# EasyEDA Pro project ProProject_FPGA_oscilloscope Analog pre circuit PCB_2024-05-13.epro, board PCB6
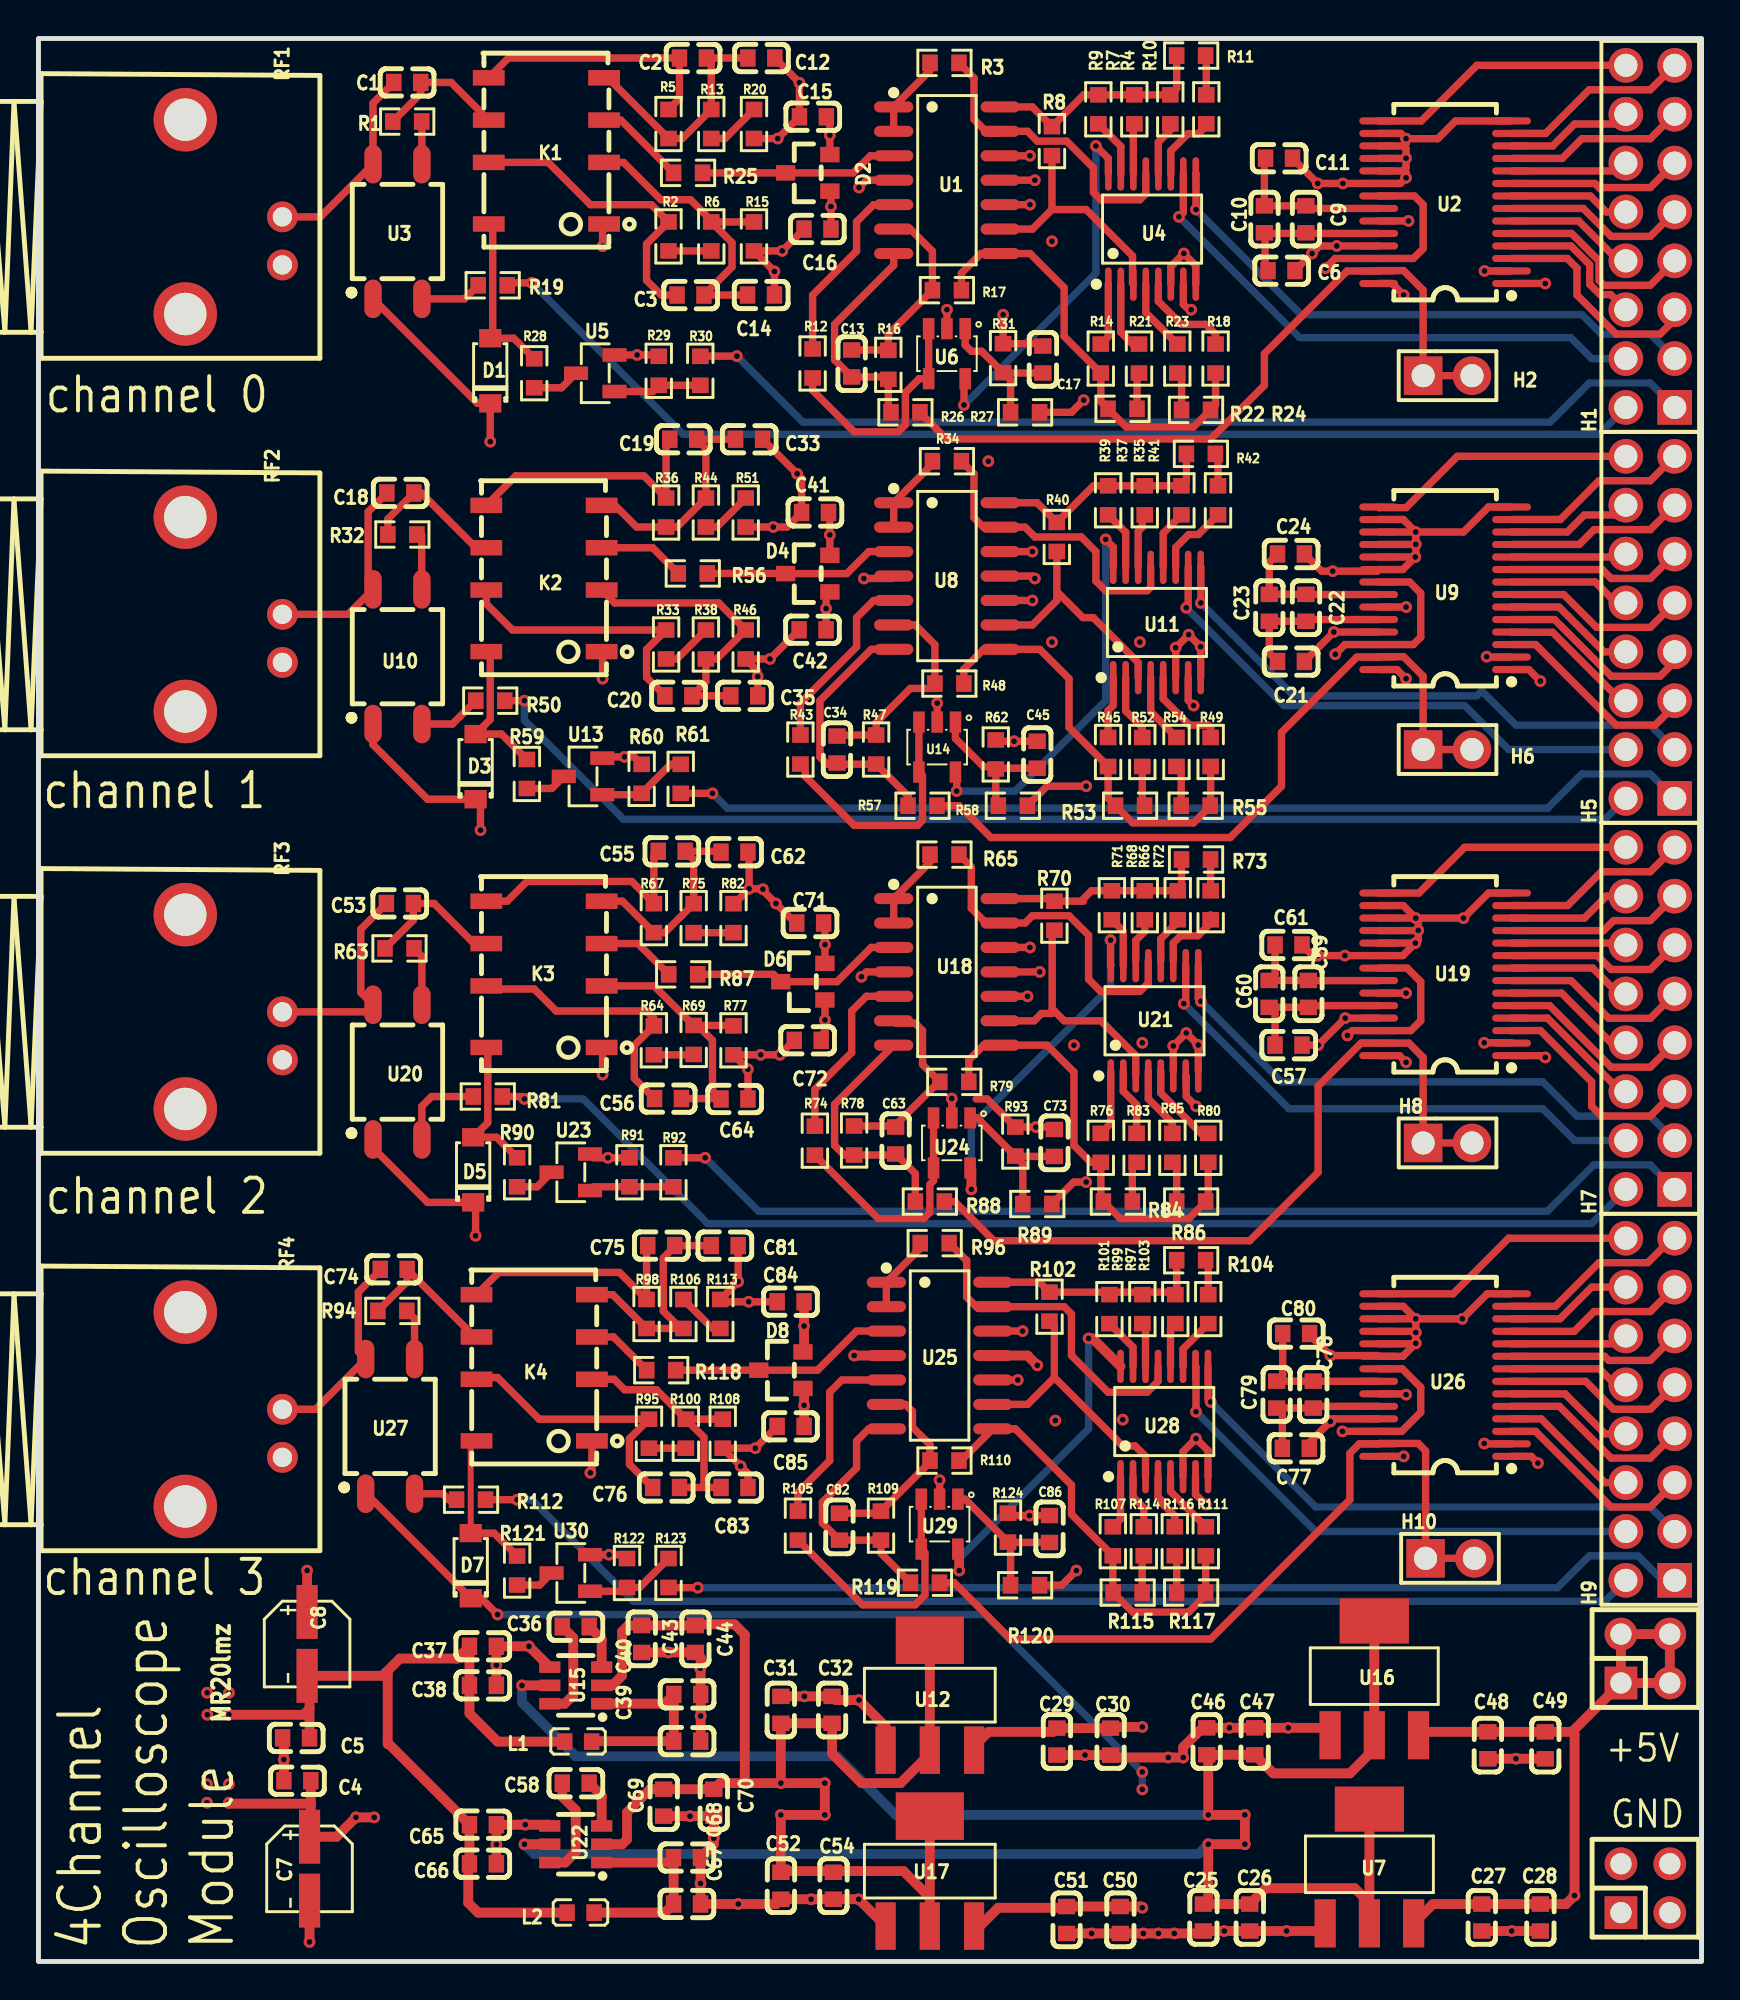
[diagram p9: board, top side]
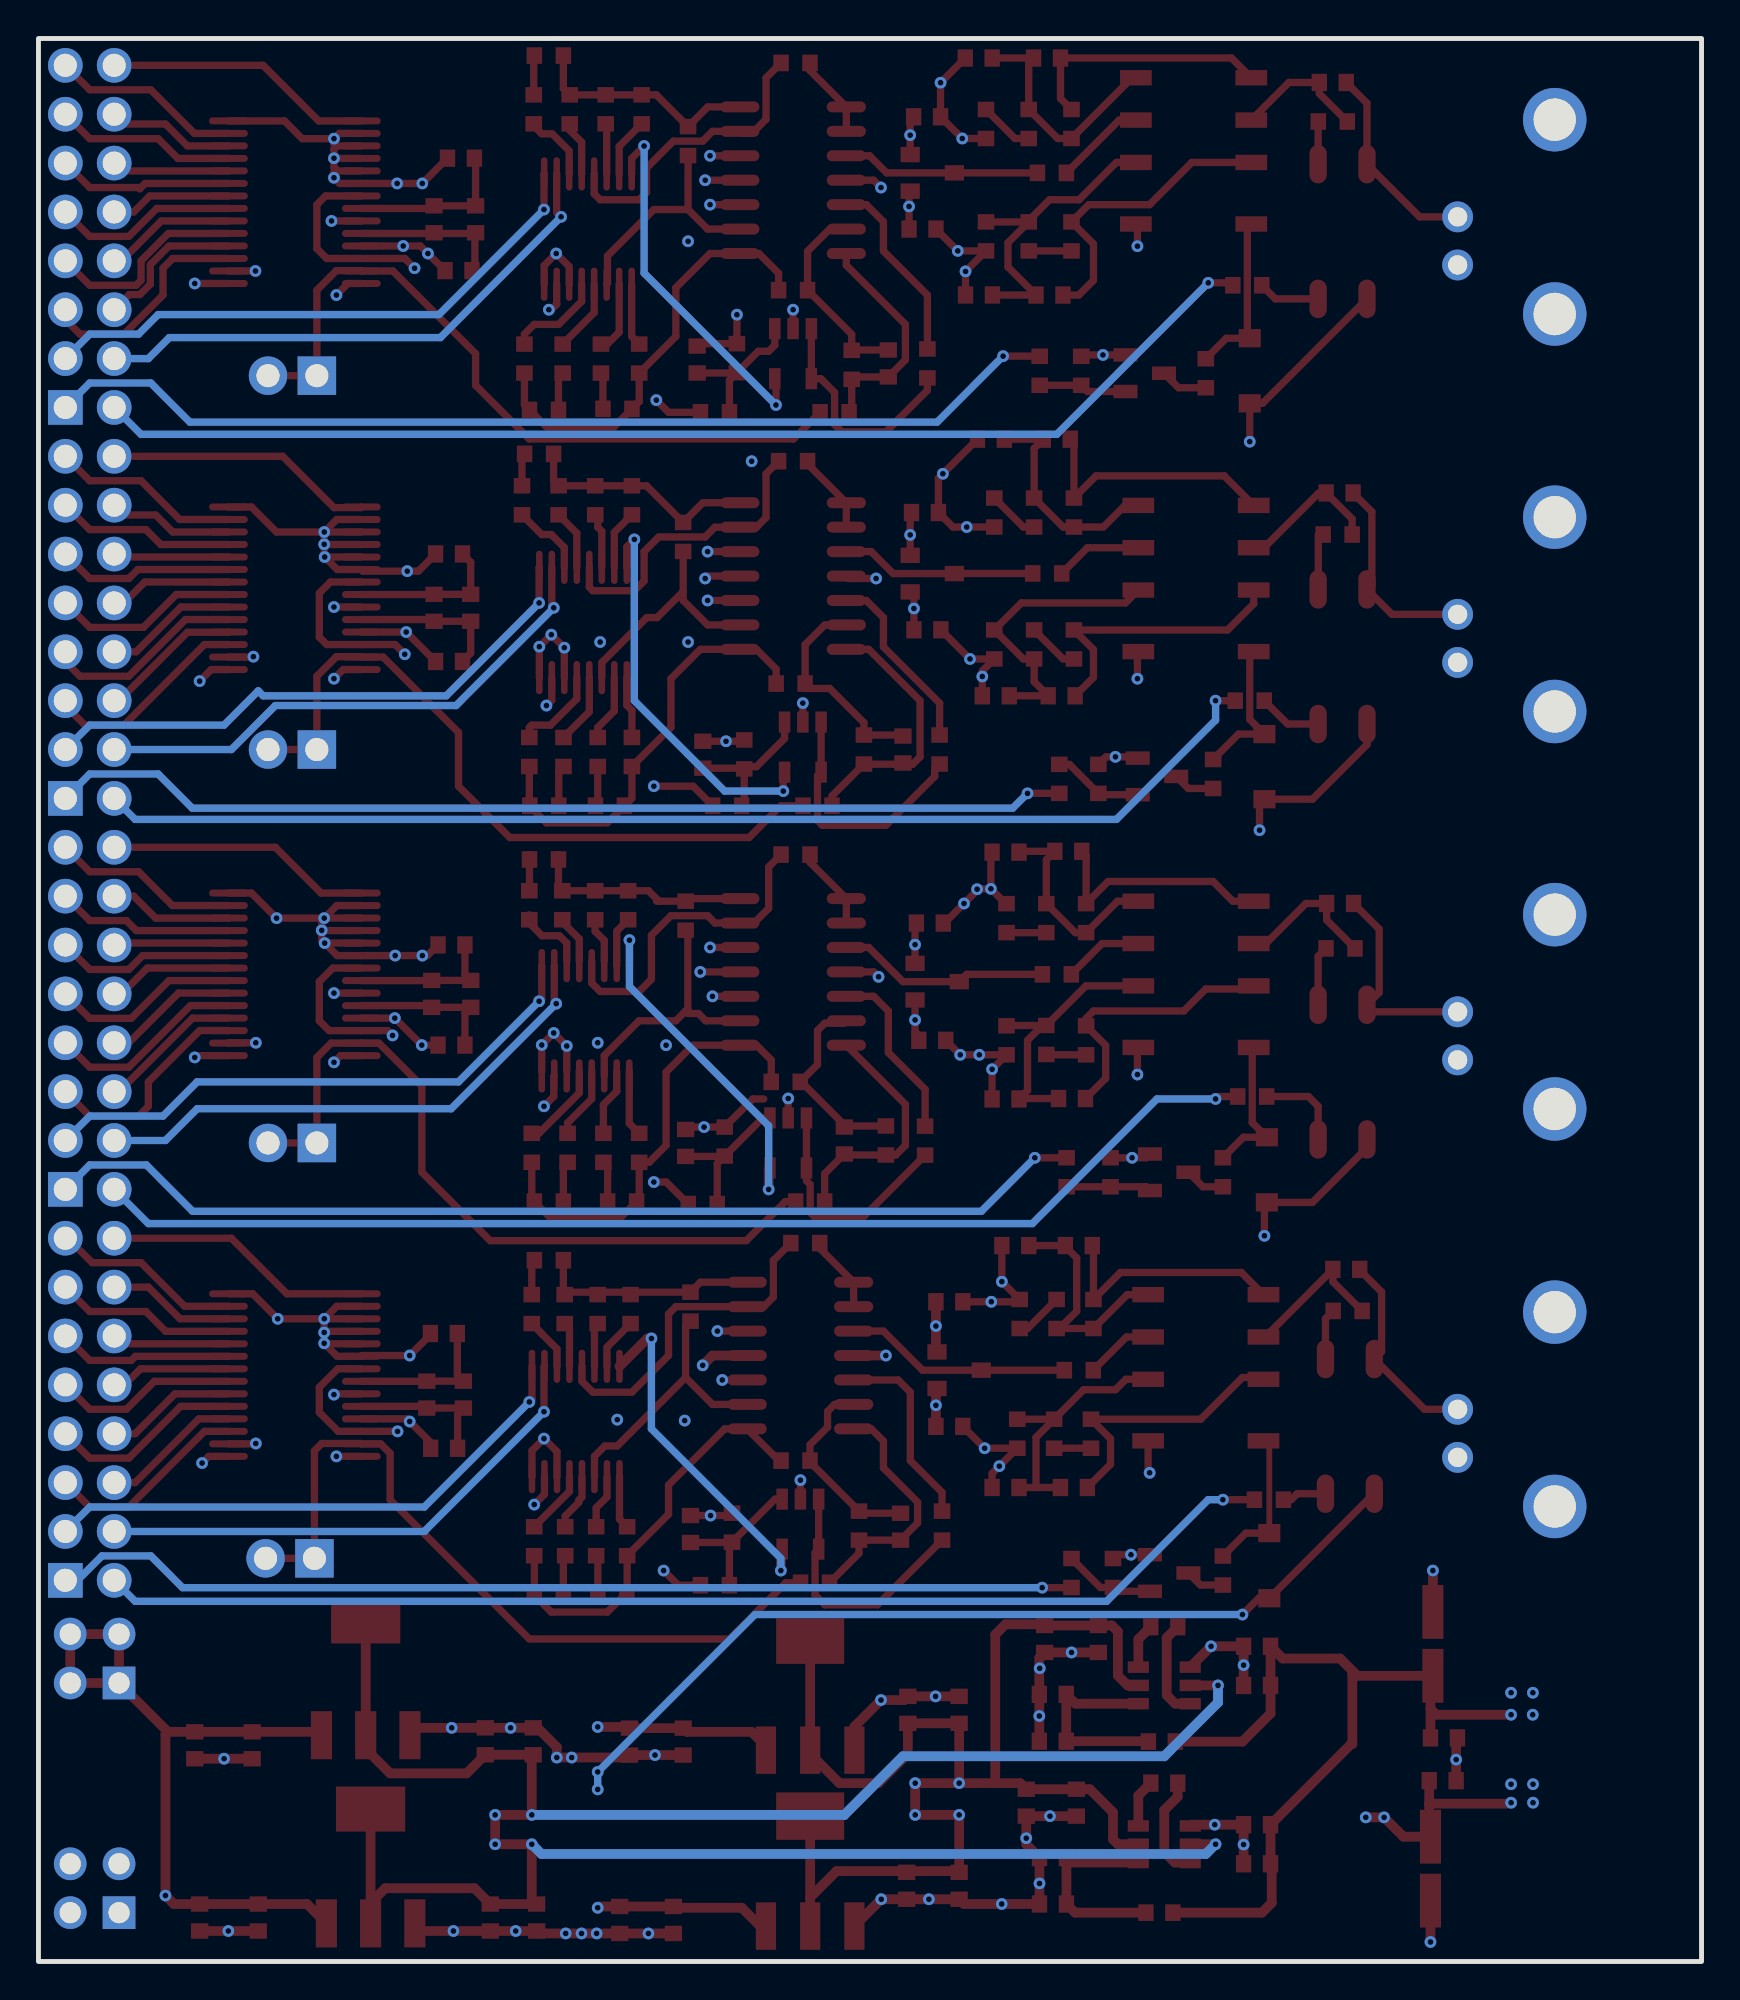
[diagram p10: board, bottom side, seen from below]

Outline 86.49 x 99.95 mm; copper layers: Top Layer, Inner1, Inner2, Bottom Layer. Coordinates in mm from the lower left corner of the outline.
Outline path: rectangle 0,99.95 86.49,0
Stack: Top Layer 0.035mm 外层铜厚1oz / Dielectric1 0.2104mm 7628 RC49% 8.6mil / Inner1 0.0152mm 内层铜厚 / Dielectric2 1.065mm 1.1mm H/HOZ 含铜 / Inner2 0.0152mm 内层铜厚 / Dielectric3 0.2104mm 7628 RC49% 8.6mil / Bottom Layer 0.035mm 外层铜厚1oz

## Design rules (mm)
template: JLCPCB Capability(Two Layers Board)
spacing copperThickness1oz (default): track to track 0.102, other pairs 0.152 to 0.3
spacing copperThickness2oz: track to track 0.203, other pairs 0.152 to 0.3
track width copperThickness1oz (default): min 0.127, default 0.254, max 2.54
track width copperThickness2oz: min 0.203, default 0.254, max 2.54
differential pair differentialPair (default): width min 0.127, default 0.254, max 2.54; gap min 0.152, default 0.152
via viaSize (default): diameter min 0.5, default 0.61, max 10; hole min 0.3, default 0.305, max 6.3

## Placement (name value [footprint] x y rotation side)
+5V  PZ254-2-02-Z-8.5  [HDR-TH_4P-P2.54-V-M-R2-C2-S2.54]  83.57 15.75 0 top
C1  22nF  [C0603]  19.18 97.66 0 top
C2  360pf  [C0603]  34.04 98.93 180 top
C3  15Pf  [C0603]  33.91 86.61 180 top
C4  104  [C0603]  13.46 9.4 180 top
C5  104  [C0603]  13.4 11.62 180 top
C6  100nf  [C0603]  64.64 87.88 180 top
C7  22uF  [CAP-SMD_BD4.0-L4.3-W4.3-FD-A]  14.1 4.83 270 top
C8  22uF  [CAP-SMD_BD4.0-L4.3-W4.3-FD-A]  13.97 16.51 270 top
C9  100nf  [C0603]  65.91 90.55 270 top
C10  10uf  [C0603]  63.75 90.55 270 top
C11  100nf  [C0603]  64.52 93.73 180 top
C12  15Pf  [C0603]  37.59 98.93 180 top
C13  360pf  [C0603]  42.29 83.06 90 top
C14  360pf  [C0603]  37.58 86.62 180 top
C15  360pf  [C0603]  40.27 95.88 0 top
C16  360pf  [C0603]  40.51 90.04 0 top
C17  100nF  [C0603]  52.23 83.26 270 top
C18  22nF  [C0603]  18.82 76.33 0 top
C19  360pf  [C0603]  33.53 79.12 180 top
C20  15Pf  [C0603]  33.28 65.79 180 top
C21  100nf  [C0603]  65.14 67.57 180 top
C22  100nf  [C0603]  65.91 70.36 270 top
C23  10uf  [C0603]  64.01 70.36 270 top
C24  100nf  [C0603]  65.14 73.16 180 top
C25  100nf  [C0603]  60.58 2.29 270 top
C26  22uf  [C0603]  62.99 2.29 270 top
C27  10uf  [C0603]  75.06 2.29 270 top
C28  100nf  [C0603]  78.11 2.29 270 top
C29  100nf  [C0603]  52.96 11.43 270 top
C30  10uf  [C0603]  55.75 11.43 270 top
C31  22uf  [C0603]  38.61 13.08 90 top
C32  100nf  [C0603]  41.27 13.08 90 top
C33  15Pf  [C0603]  36.96 79.12 180 top
C34  360pf  [C0603]  41.53 62.99 90 top
C35  360pf  [C0603]  36.7 65.79 180 top
C36  3.3uf  [C0603]  27.94 17.4 180 top
C37  100nf  [C0603]  23.11 16.38 0 top
C38  47uf  [C0603]  23.11 14.35 0 top
C39  10uf  [C0603]  33.74 11.45 0 top
C40  4.7uf  [C0603]  33.74 13.88 0 top
C41  360pf  [C0603]  40.39 75.31 0 top
C42  360pf  [C0603]  40.26 69.21 0 top
C43  10uf  [C0603]  31.37 16.76 270 top
C44  47uf  [C0603]  34.16 16.76 270 top
C45  100nF  [C0603]  51.94 62.72 270 top
C46  100nf  [C0603]  60.76 11.45 90 top
C47  22uf  [C0603]  63.25 11.45 90 top
C48  10uf  [C0603]  75.37 11.24 270 top
C49  100nf  [C0603]  78.36 11.24 270 top
C50  100nf  [C0603]  56.26 2.16 270 top
C51  10uf  [C0603]  53.47 2.16 270 top
C52  22uf  [C0603]  38.61 3.94 270 top
C53  22nF  [C0603]  18.8 54.99 0 top
C54  100nf  [C0603]  41.34 3.94 270 top
C55  360pf  [C0603]  32.93 57.7 180 top
C56  15Pf  [C0603]  32.74 44.85 180 top
C57  100nf  [C0603]  65.01 47.63 180 top
C58  3.3uf  [C0603]  27.94 9.27 180 top
C59  100nf  [C0603]  66.04 50.29 270 top
C60  10uf  [C0603]  64 50.29 270 top
C61  100nf  [C0603]  65.01 52.84 180 top
C62  15Pf  [C0603]  36.2 57.66 180 top
C63  360pf  [C0603]  44.58 42.67 90 top
C64  360pf  [C0603]  36.2 44.83 180 top
C65  100nf  [C0603]  23.11 7.11 0 top
C66  47uf  [C0603]  23.11 5.08 0 top
C67  10uf  [C0603]  33.73 2.99 0 top
C68  4.7uf  [C0603]  33.73 5.4 0 top
C69  10uf  [C0603]  32.51 8.25 270 top
C70  47uf  [C0603]  35.12 8.25 270 top
C71  360pf  [C0603]  40.13 53.97 0 top
C72  360pf  [C0603]  40.01 47.88 0 top
C73  100nF  [C0603]  52.83 42.54 270 top
C74  22nF  [C0603]  18.48 35.97 0 top
C75  360pf  [C0603]  32.39 37.21 180 top
C76  15Pf  [C0603]  32.64 24.64 180 top
C77  100nf  [C0603]  65.39 26.68 180 top
C78  100nf  [C0603]  66.29 29.46 270 top
C79  10uf  [C0603]  64.39 29.46 270 top
C80  100nf  [C0603]  65.41 32.64 180 top
C81  15Pf  [C0603]  35.69 37.21 180 top
C82  360pf  [C0603]  41.66 22.6 90 top
C83  360pf  [C0603]  36.2 24.64 180 top
C84  360pf  [C0603]  39.12 34.29 0 top
C85  360pf  [C0603]  39.12 27.81 0 top
C86  100nF  [C0603]  52.58 22.48 270 top
D1  1N4148W  [SOD-123_L2.8-W1.8-LS3.7-RD]  23.5 82.68 90 top
D2  BAV199LT1G  [SOT-23_L2.9-W1.3-P1.90-LS2.4-BR]  40.01 92.96 0 top
D3  1N4148W  [SOD-123_L2.8-W1.8-LS3.7-RD]  22.73 62.1 90 top
D4  BAV199LT1G  [SOT-23_L2.9-W1.3-P1.90-LS2.4-BR]  40.01 72.14 0 top
D5  1N4148W  [SOD-123_L2.8-W1.8-LS3.7-RD]  22.61 41.15 90 top
D6  BAV199LT1G  [SOT-23_L2.9-W1.3-P1.90-LS2.4-BR]  39.75 50.93 0 top
D7  1N4148W  [SOD-123_L2.8-W1.8-LS3.7-RD]  22.48 20.57 90 top
D8  BAV199LT1G  [SOT-23_L2.9-W1.3-P1.90-LS2.4-BR]  38.61 30.73 0 top
GND  PZ254-2-02-Z-8.5  [HDR-TH_4P-P2.54-V-M-R2-C2-S2.54]  83.57 3.81 0 top
H1  PZ254V-12-16P  [HDR-TH_16P-P2.54-V-M-R2-C8-S2.54]  83.82 89.66 90 top
H2  PZ254V-11-02P  [HDR-TH_2P-P2.54-V-M]  73.28 82.42 0 top
H5  PZ254V-12-16P  [HDR-TH_16P-P2.54-V-M-R2-C8-S2.54]  83.82 69.34 90 top
H6  PZ254V-11-02P  [HDR-TH_2P-P2.54-V-M]  73.28 62.99 0 top
H7  PZ254V-12-16P  [HDR-TH_16P-P2.54-V-M-R2-C8-S2.54]  83.82 49.02 90 top
H8  PZ254V-11-02P  [HDR-TH_2P-P2.54-V-M]  73.28 42.54 0 top
H9  PZ254V-12-16P  [HDR-TH_16P-P2.54-V-M-R2-C8-S2.54]  83.82 28.7 90 top
H10  PZ254V-11-02P  [HDR-TH_2P-P2.54-V-M]  73.41 20.95 0 top
K1  HFD4/3-S1R  [RELAY-SMD_HFD4-3-S1R]  26.42 94.11 90 top
K2  HFD4/3-S1R  [RELAY-SMD_HFD4-3-S1R]  26.29 71.88 90 top
K3  HFD4/3-S1R  [RELAY-SMD_HFD4-3-S1R]  26.29 51.31 90 top
K4  HFD4/3-S1R  [RELAY-SMD_HFD4-3-S1R]  25.78 30.86 90 top
L1  BLM18PG121SN1D  [L0603]  28.07 11.43 0 top
L2  BLM18PG121SN1D  [L0603]  28.19 2.54 0 top
R1  56Ω  [R0603]  19.18 95.63 0 top
R2  680kΩ  [R0603]  32.77 89.66 90 top
R3  1.5kΩ  [R0603]  47.12 98.68 180 top
R4  1.5kΩ  [R0603]  58.86 96.27 90 top
R5  20kΩ  [R0603]  32.77 95.5 90 top
R6  300kΩ  [R0603]  34.99 89.66 270 top
R7  1.5kΩ  [R0603]  56.99 96.27 90 top
R8  1.5kΩ  [R0603]  52.7 94.61 90 top
R9  3kΩ  [R0603]  55.12 96.27 90 top
R10  3kΩ  [R0603]  60.73 96.27 90 top
R11  1.5kΩ  [R0603]  59.94 99.06 180 top
R12  1.5kΩ  [R0603]  40.26 83.06 270 top
R13  680kΩ  [R0603]  34.99 95.5 90 top
R14  1.5kΩ  [R0603]  55.25 83.31 270 top
R15  20kΩ  [R0603]  37.21 89.66 90 top
R16  1.5kΩ  [R0603]  44.2 82.99 90 top
R17  1.5kΩ  [R0603]  47.24 86.87 180 top
R18  3kΩ  [R0603]  61.21 83.31 270 top
R19  1kΩ  [R0603]  23.62 87.12 180 top
R20  300kΩ  [R0603]  37.21 95.5 90 top
R21  3kΩ  [R0603]  57.23 83.31 270 top
R22  1.5kΩ  [R0603]  56.38 80.7 180 top
R23  3kΩ  [R0603]  59.22 83.31 270 top
R24  3kΩ  [R0603]  60.2 80.64 0 top
R25  100R  [R0603]  33.78 92.96 0 top
R26  10R  [R0603]  45.08 80.52 0 top
R27  3kΩ  [R0603]  51.31 80.52 0 top
R28  100R  [R0603]  25.78 82.55 270 top
R29  10K  [R0603]  32.26 82.68 270 top
R30  100R  [R0603]  34.42 82.68 270 top
R31  3kΩ  [R0603]  50.17 83.33 270 top
R32  56Ω  [R0603]  18.92 74.17 0 top
R33  680kΩ  [R0603]  32.64 68.45 90 top
R34  1.5kΩ  [R0603]  47.24 77.98 180 top
R35  1.5kΩ  [R0603]  59.44 75.95 90 top
R36  20kΩ  [R0603]  32.64 75.31 90 top
R37  1.5kΩ  [R0603]  57.53 75.95 90 top
R38  300kΩ  [R0603]  34.71 68.45 90 top
R39  3kΩ  [R0603]  55.63 75.95 90 top
R40  1.5kΩ  [R0603]  52.96 74.04 90 top
R41  3kΩ  [R0603]  61.34 75.95 90 top
R42  1.5kΩ  [R0603]  60.45 78.36 180 top
R43  1.5kΩ  [R0603]  39.62 62.99 270 top
R44  680kΩ  [R0603]  34.71 75.31 90 top
R45  1.5kΩ  [R0603]  55.63 62.86 270 top
R46  20kΩ  [R0603]  36.78 68.45 90 top
R47  1.5kΩ  [R0603]  43.56 62.99 90 top
R48  1.5kΩ  [R0603]  47.37 66.42 180 top
R49  3kΩ  [R0603]  60.96 62.86 270 top
R50  1kΩ  [R0603]  23.5 65.53 180 top
R51  300kΩ  [R0603]  36.78 75.31 90 top
R52  3kΩ  [R0603]  57.4 62.86 270 top
R53  1.5kΩ  [R0603]  56.77 60.07 180 top
R54  3kΩ  [R0603]  59.18 62.86 270 top
R55  3kΩ  [R0603]  60.18 60.07 0 top
R56  100R  [R0603]  34.03 72.14 0 top
R57  10R  [R0603]  45.97 60.07 0 top
R58  3kΩ  [R0603]  50.67 60.07 0 top
R59  100R  [R0603]  25.4 61.72 270 top
R60  10K  [R0603]  31.37 61.47 270 top
R61  100R  [R0603]  33.4 61.47 90 top
R62  3kΩ  [R0603]  49.78 62.74 270 top
R63  56Ω  [R0603]  18.78 52.66 0 top
R64  680kΩ  [R0603]  32 47.88 90 top
R65  1.5kΩ  [R0603]  47.12 57.53 180 top
R66  1.5kΩ  [R0603]  59.25 54.9 90 top
R67  20kΩ  [R0603]  32 54.23 90 top
R68  1.5kΩ  [R0603]  57.53 54.9 90 top
R69  300kΩ  [R0603]  34.07 47.9 270 top
R70  1.5kΩ  [R0603]  52.83 54.36 90 top
R71  3kΩ  [R0603]  55.82 54.9 90 top
R72  3kΩ  [R0603]  60.96 54.9 90 top
R73  1.5kΩ  [R0603]  60.2 57.28 180 top
R74  1.5kΩ  [R0603]  40.38 42.66 270 top
R75  680kΩ  [R0603]  34.07 54.23 90 top
R76  1.5kΩ  [R0603]  55.25 42.29 270 top
R77  20kΩ  [R0603]  36.14 47.88 90 top
R78  1.5kΩ  [R0603]  42.42 42.67 90 top
R79  1.5kΩ  [R0603]  47.63 45.72 180 top
R80  3kΩ  [R0603]  60.83 42.29 270 top
R81  1kΩ  [R0603]  23.37 44.96 180 top
R82  300kΩ  [R0603]  36.14 54.23 270 top
R83  3kΩ  [R0603]  57.11 42.29 270 top
R84  1.5kΩ  [R0603]  56.13 39.5 180 top
R85  3kΩ  [R0603]  58.97 42.29 270 top
R86  3kΩ  [R0603]  59.94 39.5 0 top
R87  100R  [R0603]  33.53 51.31 0 top
R88  10R  [R0603]  46.36 39.5 0 top
R89  3kΩ  [R0603]  51.94 39.37 0 top
R90  100R  [R0603]  24.89 41.02 270 top
R91  10K  [R0603]  30.73 41.02 270 top
R92  100R  [R0603]  33.02 41.02 270 top
R93  3kΩ  [R0603]  50.8 42.62 270 top
R94  56Ω  [R0603]  18.4 33.81 0 top
R95  680kΩ  [R0603]  31.75 27.43 90 top
R96  1.5kΩ  [R0603]  46.61 37.34 180 top
R97  1.5kΩ  [R0603]  59.12 33.91 90 top
R98  20kΩ  [R0603]  31.62 33.65 90 top
R99  1.5kΩ  [R0603]  57.41 33.91 90 top
R100  300kΩ  [R0603]  33.67 27.43 270 top
R101  3kΩ  [R0603]  55.69 33.91 90 top
R102  1.5kΩ  [R0603]  52.58 34.04 90 top
R103  3kΩ  [R0603]  60.83 33.91 90 top
R104  1.5kΩ  [R0603]  59.94 36.45 180 top
R105  1.5kΩ  [R0603]  39.5 22.66 270 top
R106  680kΩ  [R0603]  33.54 33.65 270 top
R107  1.5kΩ  [R0603]  55.87 21.84 270 top
R108  20kΩ  [R0603]  35.59 27.43 90 top
R109  1.5kΩ  [R0603]  43.82 22.66 90 top
R110  1.5kΩ  [R0603]  47.12 26.03 180 top
R111  3kΩ  [R0603]  60.71 21.84 270 top
R112  1kΩ  [R0603]  22.5 24 180 top
R113  300kΩ  [R0603]  35.46 33.65 270 top
R114  3kΩ  [R0603]  57.48 21.84 270 top
R115  1.5kΩ  [R0603]  56.64 19.18 180 top
R116  3kΩ  [R0603]  59.1 21.84 270 top
R117  3kΩ  [R0603]  59.94 19.18 0 top
R118  100R  [R0603]  32.39 30.73 0 top
R119  10R  [R0603]  46.1 19.69 0 top
R120  3kΩ  [R0603]  51.31 19.56 0 top
R121  100R  [R0603]  24.89 20.32 270 top
R122  10K  [R0603]  30.61 20.19 270 top
R123  100R  [R0603]  32.77 20.19 90 top
R124  3kΩ  [R0603]  50.42 22.55 270 top
RF1  KH-BNC75-3511  [ANT-TH_KH-BNC75-3511]  10.16 90.68 270 top
RF2  KH-BNC75-3511  [ANT-TH_KH-BNC75-3511]  10.16 70.02 270 top
RF3  KH-BNC75-3511  [ANT-TH_KH-BNC75-3511]  10.16 49.36 270 top
RF4  KH-BNC75-3511  [ANT-TH_KH-BNC75-3511]  10.16 28.7 270 top
U1  GS8094-SR  [SOIC-14_L8.7-W3.9-P1.27-LS6.0-BL]  47.24 92.58 270 top
U2  MS9280  [SSOP-28_L10.2-W5.3-P0.65-LS7.8-BL]  73.15 91.44 90 top
U3  AQY282SX  [SOP-4_L4.3-W4.4-P2.54-LS7.0-BL]  18.67 89.92 0 top
U4  74HC4052PW,118  [TSSOP-16_L5.0-W4.4-P0.65-LS6.4-BL]  57.91 90.04 0 top
U5  SI2302ADS-T1-JSM  [SOT-23-3_L2.9-W1.3-P1.90-LS2.4-BR]  28.96 82.55 0 top
U6  LMV321IDBVR  [SOT-23-5_L3.0-W1.7-P0.95-LS2.8-BR]  47.24 83.57 90 top
U7  AMS1117-3.3  [SOT-223-3_L6.5-W3.5-P3.05-LS7.0]  69.22 4.95 270 top
U8  GS8094-SR  [SOIC-14_L8.7-W3.9-P1.27-LS6.0-BL]  47.24 72.01 270 top
U9  MS9280  [SSOP-28_L10.2-W5.3-P0.65-LS7.8-BL]  73.15 71.37 90 top
U10  AQY282SX  [SOP-4_L4.3-W4.4-P2.54-LS7.0-BL]  18.67 67.82 0 top
U11  74HC4052PW,118  [TSSOP-16_L5.0-W4.4-P0.65-LS6.4-BL]  58.17 69.6 0 top
U12  AMS1117-2.5V  [SOT-223_L6.5-W3.5-P2.30-LS7.0-BR]  46.36 13.84 270 top
U13  SI2302ADS-T1-JSM  [SOT-23-3_L2.9-W1.3-P1.90-LS2.4-BR]  28.32 61.59 0 top
U14  LMV321IDBVR  [SOT-23-5_L3.0-W1.7-P0.95-LS2.8-BR]  46.74 63.12 90 top
U15  SGM3204YN6G/TR  [SOT-23-6_L2.9-W1.6-P0.95-LS2.8-BR]  27.94 14.35 0 top
U16  AMS1117-3.3  [SOT-223-3_L6.5-W3.5-P3.05-LS7.0]  69.47 14.73 270 top
U17  AMS1117-2.5V  [SOT-223_L6.5-W3.5-P2.30-LS7.0-BR]  46.36 4.7 270 top
U18  GS8094-SR  [SOIC-14_L8.7-W3.9-P1.27-LS6.0-BL]  47.24 51.43 270 top
U19  MS9280  [SSOP-28_L10.2-W5.3-P0.65-LS7.8-BL]  73.15 51.31 90 top
U20  AQY282SX  [SOP-4_L4.3-W4.4-P2.54-LS7.0-BL]  18.67 46.23 0 top
U21  74HC4052PW,118  [TSSOP-16_L5.0-W4.4-P0.65-LS6.4-BL]  58.04 48.89 0 top
U22  SGM3204YN6G/TR  [SOT-23-6_L2.9-W1.6-P0.95-LS2.8-BR]  27.94 6.1 0 top
U23  SI2302ADS-T1-JSM  [SOT-23-3_L2.9-W1.3-P1.90-LS2.4-BR]  27.69 41.02 0 top
U24  LMV321IDBVR  [SOT-23-5_L3.0-W1.7-P0.95-LS2.8-BR]  47.5 42.54 90 top
U25  GS8094-SR  [SOIC-14_L8.7-W3.9-P1.27-LS6.0-BL]  46.86 31.5 270 top
U26  MS9280  [SSOP-28_L10.2-W5.3-P0.65-LS7.8-BL]  73.15 30.48 90 top
U27  AQY282SX  [SOP-4_L4.3-W4.4-P2.54-LS7.0-BL]  18.29 27.81 0 top
U28  74HC4052PW,118  [TSSOP-16_L5.0-W4.4-P0.65-LS6.4-BL]  58.55 28.07 0 top
U29  LMV321IDBVR  [SOT-23-5_L3.0-W1.7-P0.95-LS2.8-BR]  46.86 22.73 90 top
U30  SI2302ADS-T1-JSM  [SOT-23-3_L2.9-W1.3-P1.90-LS2.4-BR]  27.69 20.19 0 top

## Footprints (pads in the part's own frame, mm; a bottom-side part is the same pattern mirrored in y, then rotated)
ANT-TH_KH-BNC75-3511
  round 1.6 hole 1: 1(0,2.525) 2(2.5,2.525)
  round 3.3 hole 2.2: 3(5.05,-2.525) 4(-5.05,-2.525)
C0603
  rect 0.8x0.9 smd: 1(-0.7,0) 2(0.7,0)
CAP-SMD_BD4.0-L4.3-W4.3-FD-A
  rect 2.8x1.1 smd: 1(-1.661,0) 2(1.661,0)
HDR-TH_2P-P2.54-V-M
  rect 2x2 hole 1.2: 1(-1.27,0)
  round 2 hole 1.2: 2(1.27,0)
HDR-TH_4P-P2.54-V-M-R2-C2-S2.54
  rect 1.7x1.7 hole 1.1: 1(-1.27,-1.27)
  round 1.7 hole 1.1: 2(-1.27,1.27) 3(1.27,-1.27) 4(1.27,1.27)
HDR-TH_16P-P2.54-V-M-R2-C8-S2.54
  rect 1.8x1.8 hole 1.2: 1(-8.89,-1.27)
  round 1.8 hole 1.2: 2(-8.89,1.27) 3(-6.35,-1.27) 4(-6.35,1.27) 5(-3.81,-1.27) 6(-3.81,1.27) 7(-1.27,-1.27) 8(-1.27,1.27) 9(1.27,-1.27) 10(1.27,1.27) 11(3.81,-1.27) 12(3.81,1.27) 13(6.35,-1.27) 14(6.35,1.27) 15(8.89,-1.27) 16(8.89,1.27)
L0603
  rect 0.8x0.864 smd: 1(-0.7,0) 2(0.7,0)
R0603
  rect 0.806x0.864 smd: 1(-0.753,0) 2(0.753,0)
RELAY-SMD_HFD4-3-S1R
  rect 0.8x1.65 smd: 1(-3.8,-3) 2(-0.6,-3) 3(1.6,-3) 4(3.8,-3) 5(3.8,3) 6(1.6,3) 7(-0.6,3) 8(-3.8,3)
SOD-123_L2.8-W1.8-LS3.7-RD
  rect 0.95x1.15 smd: 1(-1.692,0) 2(1.692,0)
SOIC-14_L8.7-W3.9-P1.27-LS6.0-BL
  oval 0.574x2.038 smd: 1(-3.81,-2.769) 2(-2.54,-2.769) 3(-1.27,-2.769) 4(0,-2.769) 5(1.27,-2.769) 6(2.54,-2.769) 7(3.81,-2.769) 8(3.81,2.769) 9(2.54,2.769) 10(1.27,2.769) 11(0,2.769) 12(-1.27,2.769) 13(-2.54,2.769) 14(-3.81,2.769)
SOP-4_L4.3-W4.4-P2.54-LS7.0-BL
  oval 0.9x2 smd: 1(-1.27,-3.5) 2(1.27,-3.5) 3(1.27,3.5) 4(-1.27,3.5)
SOT-23-3_L2.9-W1.3-P1.90-LS2.4-BR
  rect 1.25x0.7 smd: 1(1,-0.95) 2(1,0.95) 3(-1,0)
SOT-23-5_L3.0-W1.7-P0.95-LS2.8-BR
  rect 1.1x0.6 smd: 1(1.3,-0.95) 2(1.3,0) 3(1.3,0.95) 4(-1.3,0.95) 5(-1.3,-0.95)
SOT-23-6_L2.9-W1.6-P0.95-LS2.8-BR
  rect 1.1x0.6 smd: 1(1.35,-0.95) 2(1.35,0) 3(1.35,0.95) 4(-1.35,0.95) 5(-1.35,0) 6(-1.35,-0.95)
SOT-23_L2.9-W1.3-P1.90-LS2.4-BR
  rect 1x0.8 smd: 1(1.15,-0.95) 2(1.15,0.95) 3(-1.15,0)
SOT-223-3_L6.5-W3.5-P3.05-LS7.0
  rect 2.5x1.1 smd: 1(2.97,-2.3) 2(2.97,0) 3(2.97,2.3)
  rect 2.34x3.6 smd: 4(-2.97,0)
SOT-223_L6.5-W3.5-P2.30-LS7.0-BR
  rect 2.465x1.05 smd: 1(2.857,-2.3) 2(2.857,0) 3(2.857,2.3)
  rect 2.465x3.54 smd: 4(-2.857,0)
SSOP-28_L10.2-W5.3-P0.65-LS7.8-BL
  oval 0.364x2.015 smd: 1(-4.225,-3.455) 2(-3.575,-3.455) 3(-2.925,-3.455) 4(-2.275,-3.455) 5(-1.625,-3.455) 6(-0.975,-3.455) 7(-0.325,-3.455) 8(0.325,-3.455) 9(0.975,-3.455) 10(1.625,-3.455) 11(2.275,-3.455) 12(2.925,-3.455) 13(3.575,-3.455) 14(4.225,-3.455) 15(4.225,3.455) 16(3.575,3.455) 17(2.925,3.455) 18(2.275,3.455) 19(1.625,3.455) 20(0.975,3.455) 21(0.325,3.455) 22(-0.325,3.455) 23(-0.975,3.455) 24(-1.625,3.455) 25(-2.275,3.455) 26(-2.925,3.455) 27(-3.575,3.455) 28(-4.225,3.455)
TSSOP-16_L5.0-W4.4-P0.65-LS6.4-BL
  oval 0.343x1.732 smd: 1(-2.275,-2.866) 2(-1.625,-2.866) 3(-0.975,-2.866) 4(-0.325,-2.866) 5(0.325,-2.866) 6(0.975,-2.866) 7(1.625,-2.866) 8(2.275,-2.866) 9(2.275,2.866) 10(1.625,2.866) 11(0.975,2.866) 12(0.325,2.866) 13(-0.325,2.866) 14(-0.975,2.866) 15(-1.625,2.866) 16(-2.275,2.866)

## Nets
As in the schematic, except:
+5V: +5V.1 +5V.2 +5V.3 +5V.4 C27.1 C28.1 C29.1 C30.1 C48.1 C49.1 C50.1 C51.1 D1.1 D3.1 D5.1 D7.1 K1.1 K2.1 K3.1 K4.1 U3.1 U7.3 U10.1 U12.3 U16.3 U17.3 U20.1 U27.1
GND: C4.2 C5.2 C6.1 C7.2 C8.1 C11.1 C12.1 C14.1 C15.1 C16.1 C17.1 C21.1 C24.1 C25.2 C26.2 C27.2 C28.2 C29.2 C30.2 C31.2 C32.2 C33.1 C35.1 C37.2 C38.2 C39.2 C40.2 C41.1 C42.1 C43.2 C44.2 C45.1 C46.2 C47.2 C48.2 C49.2 C50.2 C51.2 C52.2 C54.2 C57.1 C61.1 C62.1 C64.1 C65.2 C66.2 C67.2 C68.2 C69.2 C70.2 C71.1 C72.1 C73.1 C77.1 C80.1 C81.1 C83.1 C84.1 C85.1 C86.1 GND.1 GND.2 GND.3 GND.4 R15.1 R20.1 R29.1 R31.1 R46.1 R51.1 R60.1 R62.1 R77.1 R82.1 R91.1 R93.1 R108.1 R113.1 R122.1 R124.1 RF1.2 RF1.3 RF1.4 RF2.2 RF2.3 RF2.4 RF3.2 RF3.3 RF3.4 RF4.2 RF4.3 RF4.4 U1.10 U1.12 U2.1 U2.14 U2.16 U2.17 U2.18 U2.19 U2.20 U2.25 U4.6 U4.8 U5.2 U6.2 U7.1 U8.10 U8.12 U9.1 U9.14 U9.16 U9.17 U9.18 U9.19 U9.20 U9.25 U11.6 U11.8 U12.1 U13.2 U14.2 U15.4 U16.1 U17.1 U18.10 U18.12 U19.1 U19.14 U19.16 U19.17 U19.18 U19.19 U19.20 U19.25 U21.6 U21.8 U22.4 U23.2 U24.2 U25.10 U25.12 U26.1 U26.14 U26.16 U26.17 U26.18 U26.19 U26.20 U26.25 U28.6 U28.8 U29.2 U30.2

## Via types
v1: diameter 0.61, hole 0.305, Top Layer to Bottom Layer, 212 vias

## Routing (per net, layer and track width the routed paths; a pad name or vN(x,y) marks a point on that pad's centre or on a via; arc(x,y) is an arc through that point)
2.5V: length 321.2
  Top Layer w0.381: v1(48.13,80.9) 48.13,82.2 U6.5 ; v1(47.75,60.83) 47.75,61.75 U14.5 ; v1(55.5,73.91) 55.89,73.52 U11.16 ; v1(42.67,92.2) 43.05,92.58 U1.4 ; D6.2 v1(40.9,52.85) 40.9,53.91 C71.2 ; U8.4 44.35,71.88 v1(42.93,71.88) ; v1(42.8,51.18) 43.05,51.43 U18.4 ; C41.2 41.16,75.24 v1(41.16,74.15) D4.2 ; v1(54.99,94.36) 55.64,93.71 55.64,92.91 ; C15.2 41.16,95.7 v1(41.16,94.92) D2.2 ; U21.16 55.75,51.77 v1(55.75,53.09)
  Top Layer w0.508: 14.16,8.2 C4.1 ; 14.16,8.2 14.16,6.55 C7.1 15.5,6.49 v1(16.51,7.49) v1(17.46,7.49) ; 14.16,8.2 9.85,8.2 ; U22.2 30.35,6.1 30.61,6.35 30.61,7.75 31.81,8.95 C69.1 C70.1 35.43,9.27 36.73,9.27 ; U17.2 46.36,3.33 ; 46.36,3.33 U17.4 ; 46.36,3.33 44.98,4.7 41.4,4.7 ; C84.2 v1(39.82,33.03) 39.82,31.74 D8.2 ; U24.5 48.51,41.18 v1(48.51,40.13) ; U28.16 54.82,32.38 v1(54.61,32.38) ; v1(38.61,9.27) 36.73,9.27 ; v1(38.61,9.27) v1(40.89,9.27) v1(40.89,7.62) v1(38.61,7.62) C52.1 38.67,4.7 41.4,4.7 ; v1(38.61,9.27) C31.1 C32.1 41.27,10.79 42.8,9.27 44.83,9.27 46.36,10.79 U12.2 U12.4 ; 36.73,9.27 36.73,16.99 36.2,17.53 34.23,17.53 C44.1 C43.1 30.67,17.46 30.35,17.15 30.35,14.86 29.85,14.35 U15.2 ; U25.4 v1(42.42,31.5) ; 41.4,4.7 C54.1 ; U29.5 47.88,21.37 v1(47.88,20.32)
  Inner2 w0.381: v1(42.8,51.18) 41.13,52.85 v1(40.9,52.85) 40.9,56.14 42.93,58.17 47.69,58.17 ; v1(55.75,53.09) 55.75,56.64 54.74,57.66 48.2,57.66 47.69,58.17 ; v1(54.99,94.36) 50.67,98.68 42.93,98.68 41.16,96.91 v1(41.16,94.92) 42.67,93.41 v1(42.67,92.2) ; 47.69,58.17 47.75,58.23 v1(47.75,60.83) ; v1(55.5,73.91) 55.5,75.95 53.47,77.98 v1(49.4,77.98) ; v1(48.13,80.9) 49.4,79.63 v1(49.4,77.98) ; v1(49.4,77.98) 44.07,77.98 41.16,75.06 v1(41.16,74.15) 42.93,72.38 v1(42.93,71.88)
  Inner2 w0.508: v1(48.51,40.13) 48.51,37.37 48.48,37.34 ; v1(42.42,31.5) 40.89,33.03 v1(39.82,33.03) 39.88,33.09 39.88,35.94 41.27,37.34 48.48,37.34 ; v1(54.61,32.38) 49.66,37.34 48.48,37.34 ; v1(47.88,20.32) 43.43,20.32 32.33,9.22 v1(9.91,9.22)
  Bottom Layer w0.381: v1(48.51,40.13) 48.51,43.43 55.75,50.67 v1(55.75,53.09) ; v1(55.5,73.91) 55.5,65.53 50.8,60.83 v1(47.75,60.83) ; v1(47.88,20.32) 47.88,20.95 54.61,27.69 v1(54.61,32.38) ; v1(48.13,80.9) 54.99,87.76 v1(54.99,94.36)
  vias: v1(8.76,9.22) v1(8.76,8.25) v1(9.91,8.25)
2V0: length 28.3
  Top Layer w0.381: v1(66.93,88.01) 67.43,88.51 71.5,88.51 72.01,89.03 72.01,91.31 71.56,91.76 69.7,91.76 ; R27.2 53.72,80.52 v1(54.36,81.15)
  Inner2 w0.381: v1(54.36,81.15) 60.07,81.15 v1(66.93,88.01)
2V1: length 29.6
  Top Layer w0.381: v1(67.44,67.94) 67.94,68.45 71.5,68.45 71.88,68.83 71.88,71.12 71.3,71.7 69.7,71.7 ; v1(54.48,61.09) 52.44,61.09 R58.2
  Inner2 w0.381: v1(54.48,61.09) 60.71,61.09 68.07,68.45
2V2: length 27.6
  Top Layer w0.381: v1(68.07,48.13) 68.32,48.38 71.37,48.38 71.88,48.89 71.88,50.93 71.18,51.63 69.7,51.63 ; R89.2 53.84,40.51 v1(54.48,40.51)
  Inner2 w0.381: v1(54.48,40.51) 60.45,40.51 v1(68.07,48.13)
2V3: length 28.6
  Top Layer w0.381: v1(53.98,20.32) 53.21,19.56 R120.2 ; 69.7,30.8 70.92,30.8 71.88,29.84 71.88,28.54 70.89,27.55 v1(67.81,27.55)
  Inner2 w0.381: v1(53.98,20.32) 62.61,20.32 67.81,25.52 v1(67.81,27.55)
+5V: length 258.8
  Top Layer w0.381: v1(29.34,89.15) 29.34,90.23 K1.1 ; v1(29.34,66.67) 29.34,68.03 K2.1 ; v1(23.5,78.99) D1.1 22.83,80.98 U3.1 ; K4.1 28.78,25.48 v1(28.7,25.4) ; v1(23.88,18.03) 23.03,18.88 D7.1 17.05,24.31 U27.1 ; v1(22.73,37.72) 22.73,39.33 D5.1 20.23,39.46 17.4,42.29 U20.1 ; v1(22.99,58.8) 22.99,60.16 D3.1 20.23,60.41 17.4,63.25 U10.1 ; K3.1 29.34,47.46 v1(29.34,46.1)
  Top Layer w0.508: 79.76,11.94 79.88,11.81 v1(79.88,3.43) 79.44,2.99 C28.1 C27.1 72.52,2.99 71.52,1.98 ; 79.76,11.94 +5V.1 ; 79.76,11.94 C49.1 C48.1 71.95,11.94 U16.3 ; U17.3 48.96,1.84 49.91,2.79 53.4,2.79 C51.1 C50.1 57.34,2.86 v1(57.4,2.79) ; v1(57.4,12.19) 55.82,12.19 55.75,12.13 52.96,12.13 52.77,11.94 49.4,11.94 48.66,11.19 U12.3 ; +5V.1 +5V.2 +5V.4 +5V.3 +5V.1
  Inner2 w0.381: v1(57.4,2.79) 79.25,2.79 v1(79.88,3.43) ; v1(23.88,18.03) 28.7,22.86 v1(28.7,25.4) 22.73,31.37 v1(22.73,37.72) 29.34,44.32 v1(29.34,46.1) 29.34,52.45 v1(22.99,58.8) 29.34,65.15 v1(29.34,66.67) 29.34,73.15 v1(23.5,78.99) 29.34,84.84 v1(29.34,89.15)
  Inner2 w0.508: v1(57.4,8.95) v1(57.4,2.79) ; v1(57.4,12.19) v1(57.4,9.85)
  Bottom Layer w0.381: v1(23.88,18.03) 49.22,18.03 v1(57.4,9.85) v1(57.4,8.95)
-2.5V: length 282.1
  Top Layer w0.381: U28.7 60.17,24.28 v1(60.71,23.75) ; C42.2 v1(40.96,70.32) 40.96,70.99 D4.1 ; 41.16,92.01 41.21,91.96 v1(41.21,91.22) 41.21,90.04 ; 59.69,85.98 59.54,86.13 U4.7 ; U21.7 59.69,46 59.69,44.96 v1(60.2,44.45) ; v1(52.07,51.43) U18.11 ; v1(51.82,71.88) 51.69,72.01 U8.11 ; D6.1 v1(40.9,48.94) 40.9,48.33 40.7,48.13 ; v1(60.07,65.28) 59.79,65.56 U11.7 ; U1.11 v1(51.82,92.58)
  Top Layer w0.508: 18.07,15.02 18.8,15.75 21.78,15.75 C37.1 C38.1 22.41,12.89 23.88,11.43 L1.1 ; 18.07,15.02 18.16,14.93 18.16,11.3 18.22,11.3 C65.1 C66.1 22.35,5.02 22.35,3.05 22.86,2.54 L2.1 ; 18.07,15.02 17.9,14.85 C8.2 14.1,14.72 14.1,13.13 ; v1(9.91,12.83) 13.79,12.83 14.1,13.13 ; D8.1 39.82,29.73 v1(39.82,28.91) C85.2 ; C5.1 14.1,13.13 ; U25.11 51.44,31.5 v1(51.94,30.99)
  Inner2 w0.381: v1(57.4,47.75) 57.4,56.64 52.7,61.34 v1(52.7,68.58) ; v1(57.4,47.75) 53.98,47.75 v1(53.85,47.62) ; v1(57.4,47.75) 60.2,44.96 v1(60.2,44.45) ; v1(52.7,89.41) 52.83,89.28 52.83,81.66 57.28,77.22 v1(57.28,68.58) ; v1(52.7,89.41) 56.39,89.41 v1(59.94,85.85) ; v1(52.7,89.41) 50.17,86.87 45.56,86.87 v1(41.21,91.22) ; v1(52.7,89.41) 52.7,91.69 v1(51.82,92.58) ; v1(52.7,68.58) 51.18,67.06 42.55,67.06 40.96,68.64 v1(40.96,70.32) ; v1(52.7,68.58) 52.7,70.99 v1(51.82,71.88) ; v1(52.7,68.58) v1(57.28,68.58) ; v1(60.07,65.28) 60.07,65.79 v1(57.28,68.58) ; 53.71,47.48 52.96,46.74 43.1,46.74 v1(40.9,48.94) ; 53.71,47.48 v1(53.85,47.62) ; 53.71,47.48 53.71,37.1 56.39,34.42 v1(56.39,28.16) 56.34,28.12 ; 39.88,28.85 42.31,26.42 51.18,26.42 v1(52.88,28.12) ; 39.88,28.85 39.88,22.86 34.8,17.78 31.75,17.78 26.8,12.83 v1(9.91,12.83) ; 39.88,28.85 v1(39.82,28.91) ; v1(53.85,47.62) 53.85,49.66 v1(52.07,51.43) ; 56.34,28.12 v1(52.88,28.12) ; 56.34,28.12 v1(60.71,23.75) ; v1(52.88,28.12) 52.88,30.05 v1(51.94,30.99)
  vias: v1(8.77,13.97) v1(8.78,12.83) v1(9.91,13.97)
GND: length 299.1
  Top Layer w0.381: U8.12 v1(51.69,73.28) ; 69.7,73.65 71.62,73.65 v1(71.63,73.66) ; v1(36.96,55.75) 36.19,54.98 R82.1 ; v1(36.96,55.75) 37.65,55.75 v1(37.67,55.73) 37.67,55.67 v1(38.35,54.99) 39.37,53.97 C71.1 ; v1(36.96,55.75) 36.96,57.6 C62.1 ; 70.99,94.34 71.12,94.22 v1(71.12,93.73) ; 70.99,94.34 71.12,94.47 v1(71.12,94.74) ; 70.99,94.34 70.97,94.36 69.7,94.36 ; v1(78.36,46.99) 78.27,47.08 U19.1 ; v1(71.76,53.59) 71.76,54.1 v1(71.63,54.23) ; v1(71.76,53.59) 71.76,53.09 v1(71.6,52.93) ; v1(71.76,53.59) 71.74,53.58 69.7,53.58 ; 69.7,28.2 67.32,28.2 v1(67.18,28.07) 66.09,26.97 C77.1 ; C45.1 v1(50.73,63.42) 49.85,63.42 R62.1 ; 71.6,32.1 70.95,31.45 69.7,31.45 69.66,31.5 v1(67.18,31.5) 66.11,32.57 C80.1 ; 71.6,32.1 69.7,32.1 ; 71.6,32.1 v1(71.63,32.13) v1(71.63,32.69) ; C84.1 v1(36.94,34.29) 35.58,34.29 R113.1 v1(36.39,35.34) C81.1 ; 69.7,95.01 70.85,95.01 v1(71.12,94.74) ; R29.1 32.19,83.5 v1(31.13,83.5) 29.96,83.5 ; U8.10 v1(51.69,70.74) ; 69.7,89.16 v1(67.52,89.16) 66.62,89.16 v1(66.23,88.77) C6.1 ; C64.1 v1(36.89,46.37) R77.1 v1(37.56,47.13) v1(38.55,47.13) C72.1 ; v1(71.62,33.4) 70.97,34.05 69.7,34.05 ; v1(71.62,33.4) 69.7,33.4 ; v1(71.62,33.4) 71.63,33.4 v1(71.63,32.69) ; v1(71.62,33.4) v1(74.05,33.4) 75.35,34.7 U26.14 ; C14.1 v1(38.28,87.84) R15.1 v1(38.68,88.91) C16.1 ; U29.2 v1(46.86,25.02) ; 69.7,73 v1(71.6,73) ; v1(71.6,73) 70.95,72.35 69.7,72.35 69.61,72.26 v1(67.31,72.26) 66.73,72.26 C24.1 ; v1(71.6,73) 71.63,73.02 v1(71.63,73.66) ; U26.1 77.63,26.25 v1(77.98,25.91) ; U2.14 73.69,95.66 72.77,94.74 v1(71.12,94.74) ; R91.1 v1(29.61,41.77) 28.88,41.77 U23.2 ; 69.7,52.93 v1(71.6,52.93) ; v1(71.6,52.93) 70.95,52.28 v1(67.94,52.28) 66.26,52.28 C61.1 ; 70.99,93.12 71.12,92.99 v1(71.12,92.71) 70.83,92.41 v1(67.83,92.41) v1(66.53,92.41) C11.1 ; 70.99,93.12 71.12,93.24 v1(71.12,93.73) ; 70.99,93.12 70.94,93.06 69.7,93.06 ; C42.1 v1(38.04,67.7) R46.1 37.4,67.08 C35.1 ; v1(51.44,50.16) U18.10 ; v1(71.12,93.73) 71.11,93.71 69.7,93.71 ; U1.12 v1(51.56,93.85) ; 69.7,54.23 71.62,54.23 ; 71.62,54.23 70.97,54.88 69.7,54.88 ; 71.62,54.23 v1(71.63,54.23) ; v1(71.63,73.66) 71.63,74.29 v1(71.62,74.3) ; U30.2 v1(29.67,21.14) 30.41,21.14 R122.1 ; U4.8 60.19,88.15 v1(59.56,88.77) 58.89,88.1 U4.6 ; R51.1 v1(38.21,74.56) 38.93,74.56 C41.1 39.69,77.09 v1(39.45,77.32) C33.1 ; C85.1 v1(37.28,26.68) R108.1 v1(36.52,25.75) 36.89,25.37 C83.1 ; C21.1 v1(67.36,69.1) 69.7,69.1 ; U11.6 v1(59.14,68.28) v1(59.82,68.96) v1(60.44,68.34) U11.8 ; v1(46.74,65.4) U14.2 ; 60.31,46.28 v1(60.31,47.64) v1(59.69,48.26) v1(59.01,47.58) 59.01,46.28 ; U19.14 75.41,55.53 v1(74.11,54.23) v1(71.63,54.23) ; U9.1 77.5,67.15 v1(78.11,66.55) ; 48.77,44.83 49.34,44.83 R93.1 v1(51.87,43.37) 52.71,43.37 C73.1 ; v1(50.17,85.59) R31.1 52.11,84.09 C17.1 ; U28.8 60.82,26.55 v1(60.2,27.18) 59.52,26.5 U28.6 ; v1(50.93,30.23) U25.10 ; C57.1 v1(66.55,47.63) v1(67.96,49.03) 69.7,49.03 ; R124.1 50.54,23.18 v1(51.54,23.18) C86.1 ; v1(71.62,74.3) 70.97,74.95 69.7,74.95 ; v1(71.62,74.3) 74.11,74.3 75.41,75.6 U9.14 ; v1(71.62,74.3) 69.7,74.3 ; U18.12 v1(51.56,52.7) ; U24.2 v1(47.5,44.85) ; R20.1 v1(38.45,94.75) C15.1 v1(39.57,97.65) C12.1 ; U13.2 29.39,62.61 v1(30.48,62.61) 30.98,62.61 R60.1 ; v1(51.18,32.77) U25.12 ; v1(71.63,32.69) 71.57,32.75 69.7,32.75 ; U1.10 v1(51.56,91.31) ; U6.2 v1(47.24,85.85) ; U2.1 v1(78.36,87.21)
  Top Layer w0.508: C28.2 v1(76.61,1.59) C27.2 ; C48.2 75.38,10.54 v1(76.83,10.54) 78.36,10.54 C49.2 ; U17.1 v1(42.66,3.24) C54.2 v1(40.18,3.24) C52.2 38.36,2.99 v1(36.39,2.99) 34.43,2.99 v1(34.43,4.06) 34.43,5.4 35.12,6.09 v1(35.12,6.41) C70.2 v1(33.88,7.55) C69.2 ; C5.2 12.76,11.56 v1(12.76,10.49) C4.2 ; U15.4 v1(25.51,16.38) C37.2 v1(23.81,15.4) C38.2 ; C8.1 v1(13.97,20.32) ; C66.2 v1(23.81,6.08) C65.2 v1(25.31,7.11) 26.52,7.11 U22.4 ; C39.2 v1(34.44,12.76) C40.2 34.44,15.79 C44.2 v1(32.76,16.06) C43.2 ; C7.2 v1(14.1,1.02) ; C29.2 v1(54.43,10.73) C30.2 55.88,10.6 v1(58.76,10.6) v1(59.53,10.6) 59.53,11.14 60.53,12.15 C46.2 v1(61.94,12.15) C47.2 v1(65,12.15) 66.79,12.15 U16.1 ; C51.2 v1(54.77,1.46) C50.2 v1(57.46,1.46) v1(58.25,1.46) v1(59.07,1.46) 60.45,1.46 C25.2 v1(61.67,1.59) C26.2 v1(64.91,1.59) 66.52,1.59 U7.1 ; U12.1 44.05,12.21 v1(42.67,13.59) 41.47,13.59 C32.2 v1(39.83,13.78) C31.2
  vias: v1(34.42,15.24) v1(37.4,66.79) v1(66.52,52.28)
0AIN1: length 38.7
  Top Layer w0.381: R26.2 47.22,79.13 60.97,79.13 63.75,81.92 63.75,83.57 68.05,87.86 69.7,87.86 69.72,87.88 70.99,87.88 72.01,86.87 H2.1 H2.2
0ANGOUT1: length 12.1
  Top Layer w0.381: R11.2 59.19,97.35 R4.2 R7.2 R9.2 54.36,97.02 R8.2 51.68,96.39 U1.14
0ANGOUT2: length 22.7
  Top Layer w0.381: R18.2 61.21,80.91 R24.2 60.06,79.76 56.57,79.76 R22.2 55.25,81.08 R14.2 53.34,84.46 53.34,86.99 51.56,88.77 U1.8 49.02,88.77 48,87.75 R17.1
0D0: length 11.8
  Top Layer w0.381: H1.5 85.09,85.34 84.33,84.58 82.04,84.58 80.01,86.61 80.01,88.01 79.51,88.51 U2.3
0D1: length 7.9
  Top Layer w0.381: H1.6 81.76,86.64 81.21,86.64 80.67,87.18 80.67,88.19 79.7,89.16 U2.4
0D2: length 10.7
  Top Layer w0.381: U2.5 79.73,89.81 81.15,88.39 81.15,87.38 81.41,87.12 83.82,87.12 H1.7
0D3: length 6.8
  Top Layer w0.381: H1.8 82.17,88.39 80.1,90.46 U2.6
0D4: length 9.6
  Top Layer w0.381: U2.7 80.33,91.11 81.79,89.66 83.82,89.66 H1.9
0D5: length 6.3
  Top Layer w0.381: U2.8 80.7,91.76 81.53,90.93 H1.10
0D6: length 9.1
  Top Layer w0.381: H1.11 83.82,92.2 81.28,92.2 81.22,92.14 80.94,92.41 U2.9
0D7: length 6.1
  Top Layer w0.381: U2.10 82.14,93.06 H1.12
0D8: length 9.4
  Top Layer w0.381: H1.13 83.82,94.74 80.26,94.74 79.24,93.71 U2.11
0D9: length 6.6
  Top Layer w0.381: U2.12 78.74,94.36 79.88,95.5 82.04,95.5 H1.14
0DIORA0: length 62.1
  Top Layer w0.381: R19.1 24.5,87.25 v1(25.65,87.25)
  Bottom Layer w0.381: v1(25.65,87.25) 33.53,79.37 81.15,79.37 H1.2
0DIORA1: length 53.5
  Top Layer w0.381: R30.1 34.43,83.44 v1(36.32,83.44)
  Bottom Layer w0.381: H1.1 83.82,82.04 80.64,82.04 78.61,80.01 39.75,80.01 v1(36.32,83.44)
0OTR: length 9.9
  Top Layer w0.381: H1.15 83.82,97.28 80.64,97.28 78.38,95.01 U2.13
0RE0: length 8.8
  Top Layer w0.381: R28.1 24.72,84.37 D1.2 23.62,84.5 23.62,90.1 K1.8
0S0: length 28.6
  Top Layer w0.381: v1(59.31,90.68) 59.54,90.91 U4.10
  Bottom Layer w0.381: H1.4 80.77,83.31 79.68,84.4 65.58,84.4 v1(59.31,90.68)
0S1: length 30
  Top Layer w0.381: U4.9 60.2,92.9 v1(60.2,91.06)
  Bottom Layer w0.381: v1(60.2,91.06) 65.66,85.6 80.26,85.6 81.28,84.58 83.82,84.58 H1.3
1AIN: length 10.2
  Top Layer w0.381: U8.3 43.18,73.28 42.04,72.14 D4.3 38.85,72.14 34.78,72.14
1AIN1: length 38.3
  Top Layer w0.381: H6.2 H6.1 72.01,66.8 70.99,67.82 69.72,67.82 69.7,67.8 68.56,67.8 64.64,63.88 64.64,61.09 61.98,58.42 49.53,58.42 47.88,60.07 R57.2
1ANGOUT1: length 12.4
  Top Layer w0.381: U8.14 51.93,75.82 R40.2 54.86,76.7 R39.2 R37.2 R35.2 59.7,76.96 R42.2
1ANGOUT2: length 22.9
  Top Layer w0.381: 48.12,66.17 48.12,67.17 49.15,68.2 U8.8 52.07,68.2 53.59,66.67 53.59,64.14 R45.2 55.63,60.46 R53.2 56.9,59.18 60.07,59.18 60.93,60.04 R55.2 60.96,60.1 R49.2
1D0: length 10.9
  Top Layer w0.381: U9.3 77.86,68.45 82.04,64.26 84.07,64.26 85.09,65.28 H5.5
1D1: length 7.4
  Top Layer w0.381: H5.6 82.3,65.53 78.74,69.09 76.62,69.09 U9.4
1D2: length 10.5
  Top Layer w0.381: 85.09,68.07 85.09,67.56 84.33,66.8 81.79,66.8 78.84,69.75 U9.5
1D3: length 6.9
  Top Layer w0.381: 82.55,68.07 81.41,68.07 79.08,70.4 U9.6
1D4: length 9.7
  Top Layer w0.381: U9.7 79.32,71.05 81.03,69.34 83.82,69.34 H5.9
1D5: length 6.4
  Top Layer w0.381: H5.10 82.04,70.61 80.95,71.7 U9.8
1D6: length 9.2
  Top Layer w0.381: 85.09,73.15 83.82,71.88 81.79,71.88 81.32,72.35 U9.9
1D7: length 6
  Top Layer w0.381: 82.55,73.15 82.4,73 U9.10
1D8: length 9.3
  Top Layer w0.381: U9.11 80.13,73.65 80.9,74.42 83.82,74.42 H5.13
1D9: length 6.5
  Top Layer w0.381: H5.14 82.04,75.18 80.39,75.18 79.51,74.3 U9.12
1DIORA0: length 61.9
  Top Layer w0.381: v1(25.27,65.53) R50.1
  Bottom Layer w0.381: v1(25.27,65.53) 25.27,64.52 30.43,59.36 81.46,59.36 H5.2
1DIORA1: length 53.3
  Top Layer w0.381: R61.1 v1(35.05,60.71)
  Bottom Layer w0.381: v1(35.05,60.71) 35.82,59.94 78.49,59.94 80.26,61.72 83.82,61.72 H5.1
1OTR: length 9.8
  Top Layer w0.381: H5.15 83.82,76.96 81.15,76.96 79.14,74.95 U9.13
1RE0: length 7.9
  Top Layer w0.381: R59.1 24.08,63.8 D3.2 23.5,64.56 23.5,67.88 K2.8
1S0: length 28.1
  Top Layer w0.381: v1(59.69,70.36) 59.79,70.46 U11.10
  Bottom Layer w0.381: v1(59.69,70.36) 64.77,65.28 74.17,65.28 76.45,62.99 82.55,62.99
1S1: length 29.9
  Top Layer w0.381: v1(60.45,70.61) 60.45,72.45 U11.9
  Bottom Layer w0.381: v1(60.45,70.61) 65.28,65.79 74.8,65.79 75.06,66.04 76.83,64.26 83.82,64.26 85.09,62.99
1Y00: length 2.9
  Top Layer w0.381: 58.24,92.91 58.24,94.56 58.86,95.18 R4.1
1Y01: length 3.1
  Top Layer w0.381: R35.1 59.44,75.18 58.49,74.24 U11.12
1Y02: length 2.5
  Top Layer w0.381: R66.1 59.25,54.03 58.36,53.15 58.36,52.01
1Y03: length 2.3
  Top Layer w0.381: U28.12 58.87,32.91 R97.1
1Y10: length 2.6
  Top Layer w0.381: R7.1 56.94,95.46 U4.14
1Y11: length 2.9
  Top Layer w0.381: U11.14 57.19,74.34 57.4,74.55 57.4,75.06 R37.1
1Y12: length 2.3
  Top Layer w0.381: R68.1 57.53,53.54 57.06,53.07 57.06,52.01
1Y13: length 2.3
  Top Layer w0.381: U28.14 57.57,32.99 R99.1
1Y20: length 3.1
  Top Layer w0.381: R9.1 56.29,94.34 U4.15
1Y21: length 3.1
  Top Layer w0.381: R39.1 56.54,74.28 U11.15
1Y22: length 2.6
  Top Layer w0.381: U21.15 56.41,53.55 R71.1
1Y23: length 2.7
  Top Layer w0.381: R101.1 56.92,31.93 U28.15
1Y30: length 3.7
  Top Layer w0.381: R10.1 60.73,95.41 60.32,95 59.78,95 58.89,94.11 U4.11
1Y31: length 3.9
  Top Layer w0.381: U11.11 59.14,73.49 59.82,74.17 60.32,74.17 R41.1
1Y32: length 3.7
  Top Layer w0.381: 59.01,52.01 59.01,52.93 59.39,53.31 60.3,53.31 60.96,53.97 60.96,54.4
1Y33: length 2.8
  Top Layer w0.381: R103.1 60.33,32.65 60.33,32.64 59.52,31.84 U28.11
1Z0: length 15.9
  Top Layer w0.381: U4.13 57.59,91.88 57.28,91.57 55.25,91.57 54.86,91.95 54.86,93.22 53.47,94.61 51.94,94.61 51.44,95.12 U1.13 49.91,95.02 49.38,95.02 48.65,95.75 48.65,97.9 R3.1
1Z1: length 16
  Top Layer w0.381: R34.1 48.65,77.32 48.65,75.05 49.15,74.55 U8.13 51.31,74.55 51.82,74.04 54.23,74.04 54.99,73.28 54.99,71.75 55.5,71.25 57.66,71.25 57.84,71.43 U11.13
1Z2: length 17
  Top Layer w0.381: R65.1 48.51,56.89 48.51,54.74 49.28,53.97 U18.13 51.31,53.97 51.69,54.36 53.59,54.36 54.61,53.34 54.61,51.05 55.25,50.42 57.28,50.42 57.71,50.86 57.71,52.01
1Z3: length 17.5
  Top Layer w0.381: R96.1 48.25,36.45 48.27,36.45 48.27,34.53 48.77,34.04 53.34,34.04 53.72,33.65 53.72,31.5 55.63,29.59 57.66,29.59 58.22,30.15 U28.13
2AIN: length 11.1
  Top Layer w0.381: R87.2 38.22,51.31 D6.3 41.53,50.93 43.31,52.7 U18.3
2AIN1: length 39.9
  Top Layer w0.381: R88.2 47.65,39.5 49.68,37.46 62.99,37.46 66.55,41.02 66.55,45.5 68.78,47.73 71.27,47.73 72.01,46.99 H8.1 H8.2
2ANGOUT1: length 11.6
  Top Layer w0.381: 54.22,55.11 R70.2 52.7,55.24 U18.14 ; 54.22,55.11 54.35,55.11 ; 54.22,55.11 54.76,55.65 R71.2 R68.2 R66.2 59.44,55.85 59.44,57.53
2ANGOUT2: length 23.3
  Top Layer w0.381: R79.1 48.38,46.85 49.15,47.62 U18.8 52.45,47.62 53.85,46.23 53.85,42.42 54.73,41.54 R76.2 55.25,39.63 R84.2 56.27,38.61 59.82,38.61 60.7,39.49 R86.2 60.83,39.63 R80.2
2D0: length 11.6
  Top Layer w0.381: U19.3 76.61,48.39 78.11,48.39 80.77,45.72 80.77,44.45 81.28,43.94 83.82,43.94 H7.5
2D1: length 7.5
  Top Layer w0.381: U19.4 78.48,49.03 82.3,45.21 H7.6
2D2: length 10.3
  Top Layer w0.381: U19.5 78.59,49.68 81.79,46.48 83.82,46.48 H7.7
2D3: length 7
  Top Layer w0.381: U19.6 79.21,50.33 81.79,47.75 H7.8
2D4: length 9.8
  Top Layer w0.381: U19.7 79.7,50.98 81.66,49.02 83.82,49.02 H7.9
2D5: length 6.5
  Top Layer w0.381: H7.10 82.17,50.29 80.83,51.63 U19.8
2D6: length 9.3
  Top Layer w0.381: U19.9 81.07,52.28 81.79,51.56 83.82,51.56 H7.11
2D7: length 6
  Top Layer w0.381: U19.10 82.45,52.93 H7.12
2D8: length 9.2
  Top Layer w0.381: U19.11 81.4,53.58 81.92,54.1 83.82,54.1 H7.13
2D9: length 6.4
  Top Layer w0.381: H7.14 81.53,55.37 80.39,54.23 76.61,54.23 U19.12
2DIORA0: length 61.9
  Top Layer w0.381: R81.1 25.15,44.96 v1(25.27,44.83)
  Bottom Layer w0.381: v1(25.27,44.83) 28.32,44.83 34.8,38.35 80.77,38.35 H7.2
2DIORA1: length 54.7
  Top Layer w0.381: R92.1 v1(34.67,41.77)
  Bottom Layer w0.381: v1(34.67,41.77) 37.46,38.99 78.46,38.99 80.88,41.4 83.82,41.4 H7.1
2OTR: length 9.7
  Top Layer w0.381: U19.13 79.52,54.88 81.28,56.64 83.82,56.64 H7.15
2RE0: length 7.7
  Top Layer w0.381: R90.1 23.83,42.84 D5.2 23.37,43.6 23.37,47.43 K3.8
2S0: length 28
  Top Layer w0.381: v1(59.56,49.78) 59.66,49.88 U21.10
  Bottom Layer w0.381: v1(59.56,49.78) 65.02,44.32 78.23,44.32 79.88,42.67 H7.4
2S1: length 29.5
  Top Layer w0.381: v1(60.45,49.91) 60.31,50.05 U21.9
  Bottom Layer w0.381: v1(60.45,49.91) 64.64,45.72 78.23,45.72 80.01,43.94 83.82,43.94 H7.3
2Y00: length 3.3
  Top Layer w0.381: 55.64,87.18 55.64,84.46 R14.1
2Y01: length 3.2
  Top Layer w0.381: U11.1 55.89,65.29 55.63,65.02 R45.1
2Y02: length 3.5
  Top Layer w0.381: 55.76,46.28 55.76,43.56 R76.1
2Y03: length 2.8
  Top Layer w0.381: U28.1 56.27,23 R107.1
2Y10: length 5.1
  Top Layer w0.381: 58.24,87.18 58.24,86.29 59.44,85.09 60.71,85.09 61.21,84.58 R18.1
2Y11: length 4.7
  Top Layer w0.381: R49.1 60.96,64.13 60.83,64.26 59.86,64.26 58.49,65.63 U11.5
2Y12: length 4.5
  Top Layer w0.381: R80.1 60.46,43.04 58.36,45.14 58.36,46.28
2Y13: length 3.4
  Top Layer w0.381: U28.5 58.87,24.43 R111.1
2Y20: length 3.7
  Top Layer w0.381: R21.1 56.9,84.07 56.29,84.68 U4.2
2Y21: length 3.5
  Top Layer w0.381: R52.1 57.4,64.13 56.54,65 U11.2
2Y22: length 3.5
  Top Layer w0.381: R83.1 57.11,44.53 56.41,45.23 56.41,46.28
2Y23: length 2.8
  Top Layer w0.381: R114.1 57.48,23.58 56.92,24.14 U28.2
2Y30: length 3.8
  Top Layer w0.381: R23.1 57.59,85.7 U4.4
2Y31: length 3.7
  Top Layer w0.381: U11.4 57.84,64.96 R54.1
2Y32: length 3.8
  Top Layer w0.381: R85.1 58.97,43.58 57.71,44.84 57.71,46.28
2Y33: length 3
  Top Layer w0.381: U28.4 58.22,24.14 58.39,23.98 58.39,23.86 59.1,23.15 R116.1
2Z0: length 12.6
  Top Layer w0.381: U4.3 56.9,87.22 56.9,88.65 54.48,91.06 52.7,91.06 ; 52.7,91.06 R8.1 ; 52.7,91.06 51.69,90.04 U1.9
2Z1: length 12.6
  Top Layer w0.381: 52.96,71.21 54.31,69.85 54.85,69.85 57.19,67.51 U11.3 ; 52.96,71.21 R40.1 ; 52.96,71.21 52.96,70.74 51.69,69.47 U8.9
2Z2: length 13.6
  Top Layer w0.381: U18.9 51.79,48.89 52.17,49.28 52.7,49.28 52.83,49.4 ; U21.3 57.06,47.09 55.25,48.89 53.34,48.89 52.83,49.4 ; 52.83,49.4 52.72,49.52 52.72,53.49 R70.1
2Z3: length 14.3
  Top Layer w0.381: R102.1 52.83,33.03 52.83,30.35 ; 52.83,30.35 56.39,26.8 57.03,26.8 57.57,26.26 U28.3 ; 52.83,30.35 51.44,28.96 U25.9
3.3: length 244.2
  Top Layer w0.381: 75.18,87.88 v1(75.2,87.86) U2.2 ; 69.7,29.5 71.08,29.5 v1(71.12,29.46) ; 69.7,67.15 70.65,67.15 v1(71.12,66.67) ; 69.7,70.4 v1(71.12,70.4) ; v1(75.18,26.92) 75.2,26.9 U26.2 ; 69.7,50.33 v1(71.12,50.33) ; v1(71.12,46.74) 70.77,47.08 69.7,47.08 ; v1(75.31,67.82) 75.33,67.8 U9.2 ; v1(75.18,47.75) 76.59,47.75 U19.2 ; v1(70.99,86.61) 70.39,87.21 69.7,87.21 ; 69.7,90.46 v1(71.25,90.46) ; 69.7,26.25 v1(70.99,26.25)
  Top Layer w0.508: 69.22,3.05 U7.2 ; 69.22,3.05 68.45,3.81 63.82,3.81 C26.1 C25.1 60.83,3.24 v1(60.83,6.1) v1(62.74,6.1) v1(62.74,7.62) v1(60.83,7.62) 60.83,10.67 C46.1 C47.1 64.22,9.78 68.2,9.78 69.47,11.05 U16.2 U16.4 ; 69.22,3.05 U7.4 ; U22.5 v1(25.27,6.1) ; v1(25.15,14.35) U15.5
  Inner2 w0.381: v1(71.12,46.74) 74.17,46.74 v1(75.18,47.75) ; v1(71.12,46.74) v1(71.12,50.33) 70.62,50.83 70.62,66.18 v1(71.12,66.67) ; v1(71.12,46.74) 70.36,45.97 70.36,30.23 v1(71.12,29.46) 71.12,26.38 ; 71.12,26.38 v1(70.99,26.25) 70.99,25.15 62.74,16.89 v1(62.74,7.62) ; 71.12,26.38 71.66,26.92 v1(75.18,26.92) ; v1(75.31,67.82) 74.17,66.67 v1(71.12,66.67) ; v1(71.25,90.46) 71.25,86.87 ; 71.25,86.87 72.24,87.86 v1(75.2,87.86) ; 71.25,86.87 v1(70.99,86.61) 70.48,86.11 70.48,71.03 v1(71.12,70.4) v1(71.12,66.67)
  Bottom Layer w0.508: v1(25.15,14.35) 25.15,13.46 27.94,10.67 41.53,10.67 44.58,7.62 v1(60.83,7.62) ; v1(60.83,6.1) 60.33,5.59 25.78,5.59 v1(25.27,6.1)
3AIN: length 11.8
  Top Layer w0.381: U25.3 42.55,32.77 40.51,30.73 D8.3 R118.2
3AIN1: length 40.4
  Top Layer w0.381: R119.2 47.63,19.69 50.55,16.76 60.96,16.76 68.2,24 68.2,26.42 68.69,26.9 69.7,26.9 69.72,26.92 71.76,26.92 72.14,26.54 H10.1 H10.2
3ANGOUT1: length 11.6
  Top Layer w0.381: R104.2 59.19,34.73 R97.2 58.99,34.79 R102.2 52.06,35.31 U25.14
3ANGOUT2: length 21.9
  Top Layer w0.381: R111.2 60.7,21.08 R117.2 60.7,19.04 59.82,18.16 56.9,18.16 R115.2 55.87,19.19 R107.2 53.72,23.24 53.72,24.76 50.8,27.69 U25.8 47.98,26.03 R110.1
3D0: length 10.6
  Top Layer w0.381: H9.5 83.82,23.62 81.79,23.62 77.86,27.55 U26.3
3D1: length 7.3
  Top Layer w0.381: H9.6 81.46,24.89 78.15,28.2 U26.4
3D2: length 10.1
  Top Layer w0.381: 85.09,27.43 83.82,26.16 81.79,26.16 79.1,28.85 U26.5
3D3: length 6.8
  Top Layer w0.381: 82.55,27.43 81.46,27.43 79.39,29.5 U26.6
3D4: length 9.6
  Top Layer w0.381: H9.9 83.82,28.7 81.92,28.7 80.46,30.15 U26.7
3D5: length 6.3
  Top Layer w0.381: H9.10 82.01,29.97 81.18,30.8 U26.8
3D6: length 9.1
  Top Layer w0.381: U26.9 81.45,31.45 81.66,31.24 83.82,31.24 85.09,32.51
3D7: length 6.1
  Top Layer w0.381: U26.10 82.14,32.1 82.55,32.51
3D8: length 9.4
  Top Layer w0.381: U26.11 79.87,32.75 80.9,33.78 83.82,33.78 H9.13
3D9: length 6.6
  Top Layer w0.381: U26.12 79.13,33.4 80.77,35.05 H9.14
3DIORA0: length 61.9
  Top Layer w0.381: v1(24.89,24) R112.1
  Bottom Layer w0.381: v1(24.89,24) 25.65,24 30.94,18.72 81.46,18.72 H9.2
3DIORA1: length 53.5
  Top Layer w0.381: R123.1 32.77,19.43 v1(34.29,19.43)
  Bottom Layer w0.381: v1(34.29,19.43) 78.99,19.43 80.64,21.08 83.19,21.08 84.45,19.81 H9.1
3OTR: length 9.9
  Top Layer w0.381: H9.15 84.96,37.59 83.69,36.32 81.15,36.32 78.89,34.05 U26.13
3RE0: length 7.8
  Top Layer w0.305: D7.2 22.48,26.76 K4.8
  Top Layer w0.381: D7.2 23.7,22.27 R121.1
ADC0_CLK: length 14
  Top Layer w0.381: 69.7,95.66 71.92,95.66 74.8,98.55 H1.16
ADC1_CLK: length 14
  Top Layer w0.381: H5.16 73.79,78.23 71.12,75.56 69.73,75.56 69.7,75.6
ADC2_CLK: length 13.8
  Top Layer w0.381: 69.7,55.53 71.79,55.53 74.17,57.91 H7.16
ADC3_CLK: length 14
  Top Layer w0.381: H9.16 76.45,37.59 73.57,34.7 69.7,34.7
AIN0: length 10.3
  Top Layer w0.381: U1.3 43.27,93.85 42.38,92.96 D2.3 R25.2
S03: length 27.3
  Top Layer w0.381: v1(60.2,28.57) 60.2,30.91 U28.10
  Bottom Layer w0.381: H9.4 66.42,22.35 v1(60.2,28.57)
S13: length 28.8
  Top Layer w0.381: v1(60.96,29.08) 60.82,29.22 U28.9
  Bottom Layer w0.381: H9.3 83.82,23.62 66.42,23.62 v1(60.96,29.08)
$1N7577: length 10.5
  Top Layer w0.381: C1.1 17.4,96.58 17.4,93.42 14.66,90.68 RF1.1
$1N7578: length 3.2
  Top Layer w0.381: R19.2 22.16,86.42 U3.2
$1N7582: length 2.2
  Top Layer w0.381: R1.2 19.94,95.62 19.94,93.42
$1N7586: length 16
  Top Layer w0.381: C3.2 32.39,86.61 31.62,87.38 31.62,89.27 R2.2 31.87,91.31 28.7,91.31 26.51,93.51 K1.7
$1N7587: length 4.7
  Top Layer w0.381: K1.3 30.29,95.71 R25.1
$1N7592: length 4.6
  Top Layer w0.381: U5.1 31.93,81.6 R29.2 R30.2
$1N7596: length 2.5
  Top Layer w0.381: U5.3 27.2,81.8 R28.2
$1N7605: length 16.2
  Top Layer w0.381: R6.1 R15.2 ; R6.1 34.99,90.49 33.91,91.57 32.37,91.57 30.43,93.51 K1.2 ; R6.1 36.07,89.34 36.07,88.07 C3.1 36.87,86.61 C14.2
$1N7665: length 10.7
  Top Layer w0.508: L1.2 28.79,11.45 C39.1 C40.1 32.56,13.4 U15.1
$1N7669: length 8
  Top Layer w0.381: 63.79,89.81 63.79,88.04 63.94,87.88 ; 63.79,89.81 C10.2 ; 63.79,89.81 69.7,89.81
$1N7671: length 8.6
  Top Layer w0.381: 69.7,91.11 65.91,91.11 C9.1 C10.1 63.75,93.66 C11.2
$1N7673: length 5.2
  Top Layer w0.508: C36.2 27.81,16.83 27.81,13.84 27.37,13.4 U15.6
$1N7674: length 2.4
  Top Layer w0.508: C36.1 29.29,16.75 U15.3
$1N7676: length 12.4
  Top Layer w0.381: C12.2 C2.1 34.99,98.68 R13.2 33.48,94.75 R5.1 29.61,97.91 K1.4
$1N7693: length 4.3
  Top Layer w0.381: R3.2 46.36,98.28 U1.1 U1.2
$1N7724: length 1.9
  Top Layer w0.381: R22.1 57.13,82.45 R21.2
$1N7725: length 2.1
  Top Layer w0.381: R11.1 60.73,99.03 R10.2
$1N7730: length 2
  Top Layer w0.381: R24.1 59.44,82.34 R23.2
$1N7731: length 2.8
  Top Layer w0.381: R13.1 35.7,94.75 R20.2
$1N7732: length 2.2
  Top Layer w0.381: R2.1 R6.2
$1N7733: length 7
  Top Layer w0.381: K1.6 21.46,97.66 C1.2 19.88,97.08 R1.1
$1N7778: length 7.7
  Top Layer w0.381: 50.18,82.56 R31.2 49.05,83.69 48.51,83.69 48.19,84.01 U6.1 ; 50.18,82.56 52.23,82.56 ; 50.18,82.56 50.55,82.19 R27.1
$1N7779: length 12.3
  Top Layer w0.381: R12.2 40.26,81.66 42.42,79.5 44.7,79.5 45.08,79.88 45.08,81.55 45.8,82.27 U6.4 U6.3
$1N7780: length 13.3
  Top Layer w0.381: R5.2 33.34,96.83 C2.2 24.44,98.93 K1.5
$1N7783: length 11.8
  Top Layer w0.381: R26.1 44.2,80.65 R16.1 44.07,82.36 C13.1 41.4,83.25 41.4,85.09 44.48,88.16 U1.7
$1N7784: length 10.5
  Top Layer w0.381: C13.2 44.18,83.76 44.2,83.74 44.2,84.57 R17.2 46.49,88.89 45.34,90.04 U1.6
$1N7785: length 9.9
  Top Layer w0.381: R12.1 40.26,86.61 42.55,88.9 42.55,90.42 43.43,91.31 U1.5
$1N14945: length 10.8
  Top Layer w0.381: RF2.1 16.1,70.02 U10.4 17.15,71.57 17.15,75.35 C18.1
$1N14946: length 3.3
  Top Layer w0.381: R50.2 21.53,64.32 U10.2
$1N14950: length 2.9
  Top Layer w0.381: 19.93,74.17 19.93,71.33 U10.3
$1N14954: length 14.9
  Top Layer w0.381: C20.2 31.62,66.74 31.62,68.19 R33.2 24.65,69.21 23.29,70.56 K2.7
$1N14955: length 4.5
  Top Layer w0.381: 29.29,73.48 31.94,73.48 R56.1
$1N14958: length 4.7
  Top Layer w0.381: U13.1 31.3,60.64 R60.2 32.88,62.22 R61.2
$1N14962: length 2.2
  Top Layer w0.381: R59.2 26.69,60.97 U13.3
$1N14971: length 15.3
  Top Layer w0.381: 36,65.79 33.98,65.79 34.71,66.52 R38.1 35.27,67.7 R46.2 35.37,70.61 29.96,70.61 K2.2
$1N15015: length 8
  Top Layer w0.381: C21.2 64.01,68 C23.2 C22.2 66,69.75 69.7,69.75
$1N15017: length 8
  Top Layer w0.381: C24.2 64.01,72.73 C23.1 C22.1 65.92,71.05 69.7,71.05
$1N15019: length 11.8
  Top Layer w0.381: K2.4 29.98,75.68 31.11,74.56 R36.1 33.2,74.56 R44.2 34.71,78.64 C19.1 C33.2
$1N15036: length 4.3
  Top Layer w0.381: U8.2 U8.1 46.49,77.83 R34.2
$1N15067: length 2.1
  Top Layer w0.381: R52.2 57.4,60.19 R53.1
$1N15068: length 1.7
  Top Layer w0.381: R42.1 61.34,78.22 R41.2
$1N15073: length 2.1
  Top Layer w0.381: R54.2 59.43,61.87 59.43,60.07
$1N15074: length 2.7
  Top Layer w0.381: R44.1 35.27,74.56 R51.2
$1N15075: length 2.7
  Top Layer w0.381: R33.1 33.2,67.7 R38.2
$1N15076: length 7.7
  Top Layer w0.381: R32.1 18.17,74.98 C18.2 19.91,76.33 22.75,73.48 23.29,73.48
$1N15087: length 7.7
  Top Layer w0.381: C45.2 49.82,62.02 R62.2 ; R58.1 49.78,60.21 R62.2 ; R62.2 49.67,62.1 49.15,62.1 47.69,63.57 U14.1
$1N15088: length 13.2
  Top Layer w0.381: U14.3 U14.4 45.97,61.63 45.97,59.31 45.72,59.05 42.42,59.05 39.88,61.59 39.88,61.98 R43.2
$1N15089: length 13.6
  Top Layer w0.381: K2.5 24.82,77.22 31.49,77.22 R36.2 32.64,78.93 C19.2
$1N15092: length 14
  Top Layer w0.381: 45.22,59.94 45.22,60.58 43.57,62.23 ; U8.7 43.31,68.2 40.64,65.53 40.64,62.61 41.02,62.23 41.59,62.23 ; 43.57,62.23 R47.1 ; 43.57,62.23 41.59,62.23 ; 41.59,62.23 C34.1
$1N15093: length 11.3
  Top Layer w0.381: C34.2 41.58,63.75 R47.2 43.56,64.39 45.34,66.17 46.62,66.17 46.62,68.44 45.59,69.47 U8.6
$1N15094: length 9.6
  Top Layer w0.381: U8.5 43.43,70.74 42.55,69.85 42.55,68.33 39.62,65.4 R43.1
$1N24491: length 10.9
  Top Layer w0.381: C53.1 16.76,53.66 16.76,50.36 U20.4 17.03,49.36 RF3.1
$1N24492: length 4.6
  Top Layer w0.381: R81.2 20.45,44.96 19.94,44.45 U20.2
$1N24496: length 3.1
  Top Layer w0.381: 19.53,52.66 19.94,52.25 U20.3
$1N24500: length 14.4
  Top Layer w0.381: K3.7 23.45,50.55 25.78,50.55 26.92,49.4 31.62,49.4 32,49.02 R64.2 30.99,47.62 30.99,45.9 C56.2
$1N24501: length 4.1
  Top Layer w0.381: R87.1 31.17,52.91 K3.3
$1N24504: length 4.4
  Top Layer w0.381: U23.1 28.88,40.27 R91.2 R92.2
$1N24508: length 2.1
  Top Layer w0.381: U23.3 25.93,40.27 R90.2
$1N24517: length 14.1
  Top Layer w0.381: 35.47,44.85 C64.2 ; 35.47,44.85 35.05,45.27 35.05,47.88 34.28,48.65 ; 35.47,44.85 C56.1 ; K3.2 32.02,50.71 34.07,48.65 34.28,48.65 ; 34.28,48.65 36.13,48.65 R77.2
$1N24561: length 7.8
  Top Layer w0.381: C57.2 64.31,49.29 C60.2 C59.2 66.13,49.68 69.7,49.68
$1N24563: length 7.7
  Top Layer w0.381: C61.2 64.31,51.3 C60.1 C59.1 66.05,50.98 69.7,50.98
$1N24565: length 10.9
  Top Layer w0.381: C62.2 35.45,57.7 C55.1 34.07,57.26 R75.2 32.57,53.48 R67.1 30.37,55.11 K3.4
$1N24582: length 4.3
  Top Layer w0.381: U18.2 U18.1 46.36,57.13 R65.2
$1N24613: length 2.1
  Top Layer w0.381: R83.2 56.89,41.32 R84.1
$1N24614: length 1.9
  Top Layer w0.381: 60.95,57.53 60.95,55.66 R72.2
$1N24619: length 2.1
  Top Layer w0.381: R85.2 59.19,41.32 R86.1
$1N24620: length 2.1
  Top Layer w0.381: R75.1 R82.2
$1N24621: length 2.1
  Top Layer w0.381: R69.2 34.06,47.13 R64.1
$1N24622: length 7.6
  Top Layer w0.381: K3.6 22.66,52.91 20.57,54.99 C53.2 19.5,54.13 R63.1
$1N24633: length 7.8
  Top Layer w0.381: C73.2 50.82,41.84 ; 50.82,41.84 51.19,41.47 R89.1 ; 50.82,41.84 R93.2 48.82,43.84 U24.1
$1N24634: length 12.5
  Top Layer w0.381: R74.2 43.68,38.61 46.03,38.61 46.36,38.93 46.36,40.39 46.55,40.58 U24.4 U24.3
$1N24635: length 12.4
  Top Layer w0.381: K3.5 24.37,55.11 25.4,56.13 30.86,56.13 32,54.99 ; C55.2 32,57.48 32,54.99 ; 32,54.99 R67.2
$1N24638: length 12.8
  Top Layer w0.381: U18.7 41.4,44.55 41.4,42.42 41.9,41.92 R78.1 44.52,41.92 C63.1 45.6,40.95 R88.1
$1N24639: length 10.2
  Top Layer w0.381: 44.52,43.43 R78.2 ; 44.52,43.43 44.58,43.37 ; 44.52,43.43 46.82,45.72 R79.2 45.97,46.62 45.97,48.39 45.59,48.77 44.6,48.77 U18.6
$1N24640: length 9.3
  Top Layer w0.381: U18.5 43.05,50.16 42.29,49.4 42.29,47.24 40.38,45.33 R74.1
$1N27376: length 10.7
  Top Layer w0.381: RF4.1 14.41,28.7 U27.4 16.64,31.69 16.64,34.8 17.78,35.94 C74.1
$1N27377: length 2.4
  Top Layer w0.381: U27.2 21.03,24.31 21.34,24 21.87,24
$1N27381: length 2.7
  Top Layer w0.381: R94.2 19.56,33.41 U27.3
$1N27385: length 14.4
  Top Layer w0.381: C76.2 30.73,25.84 30.73,27.17 R95.2 26.04,28.19 23.88,30.35 22.87,30.35 K4.7
